# EAGLE design SAMD21_Pro_RF_1W (EAGLE 9.1.3)
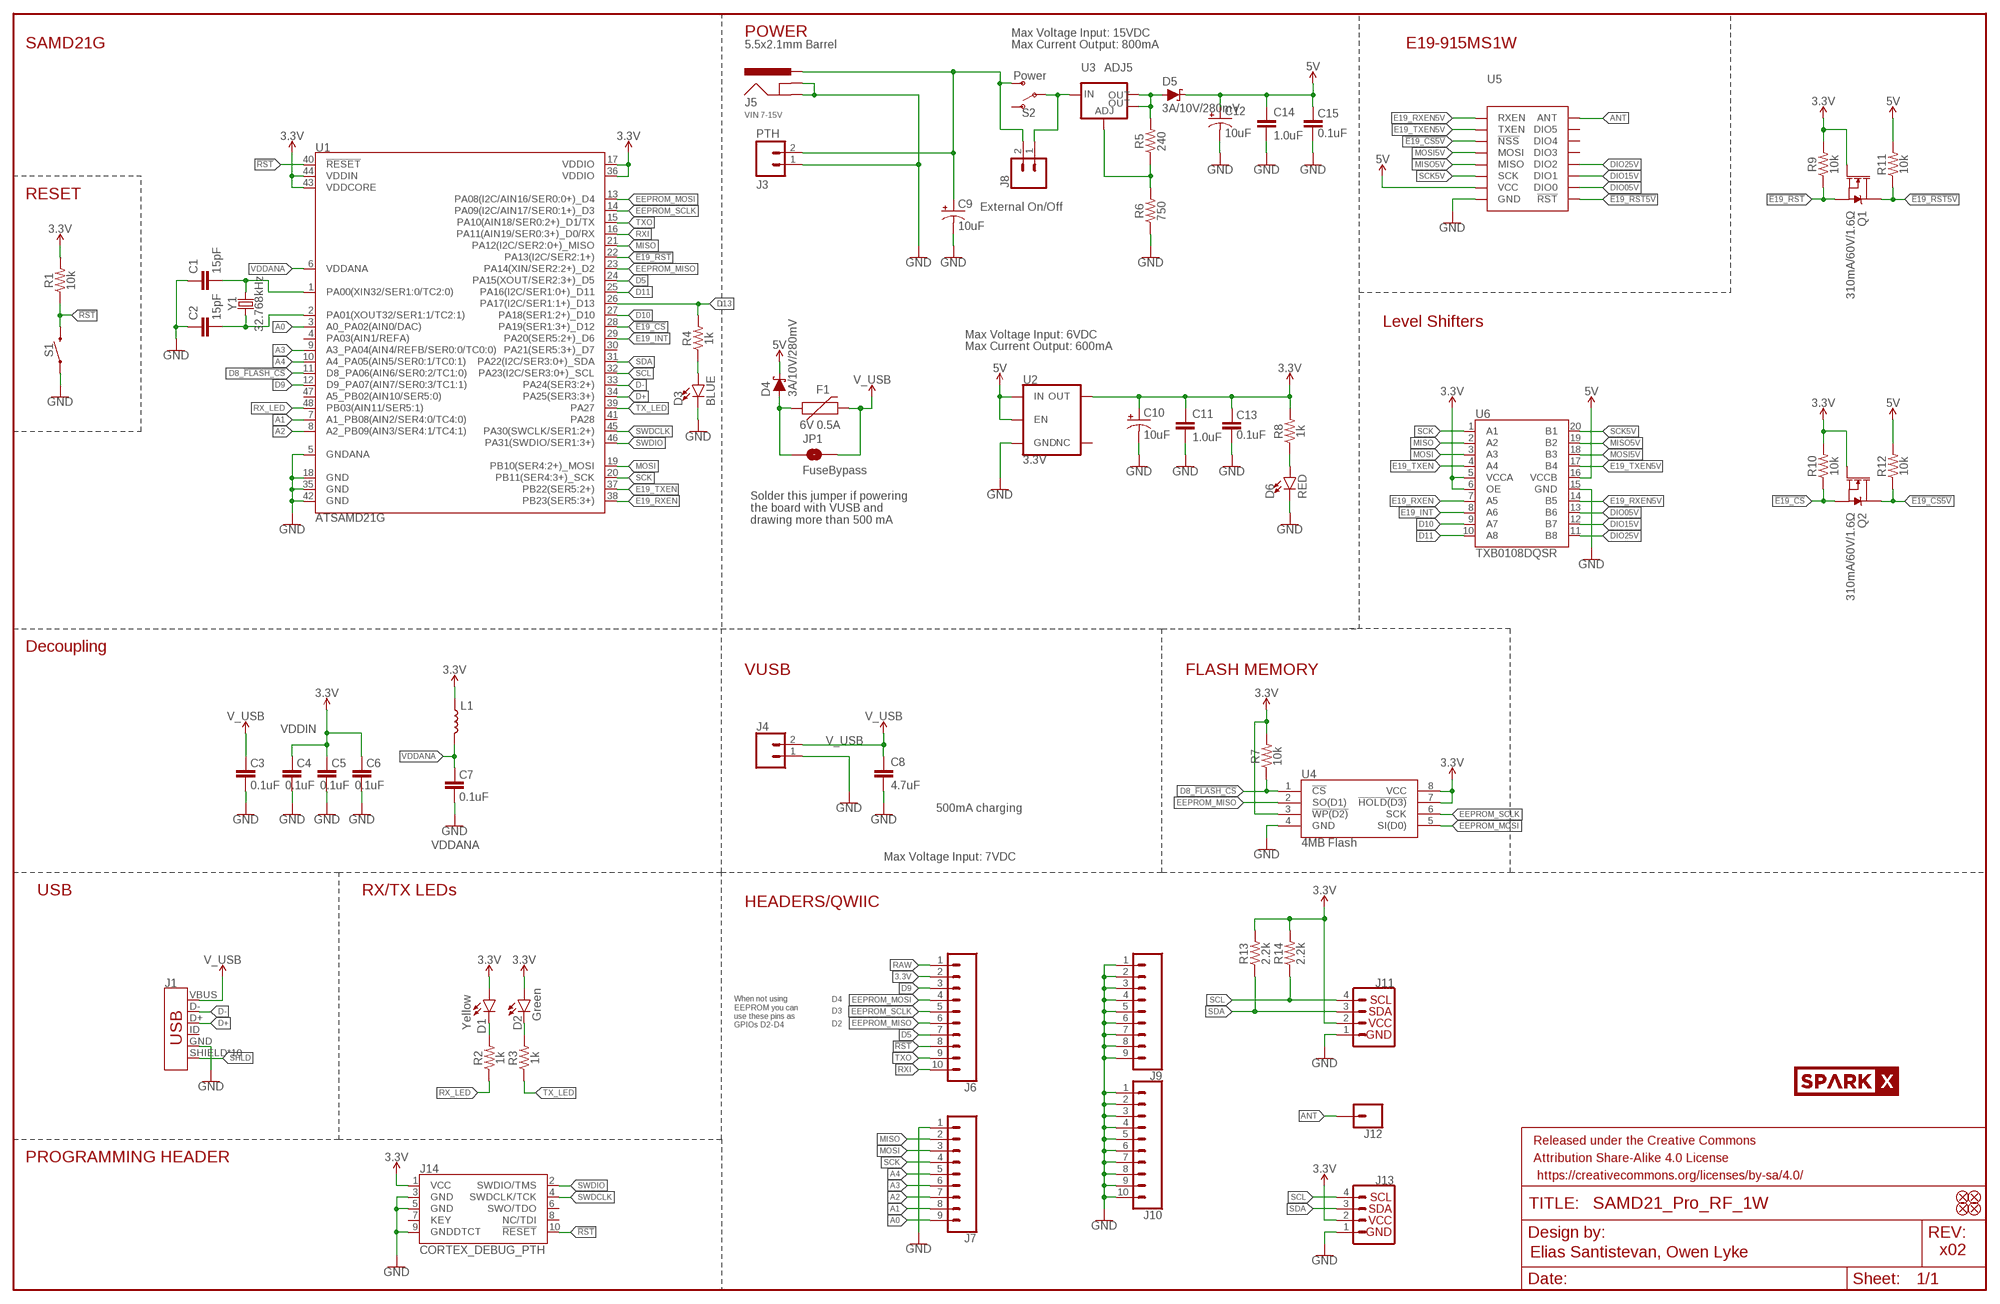
[diagram p0: schematic, sheet 1]

## Parts
C1  15pF  15PF-0603-50V-5%  [0603]
C2  15pF  15PF-0603-50V-5%  [0603]
C3  0.1uF  0.1UF-0603-25V-(+80/-20%)  [0603]
C4  0.1uF  0.1UF-0603-25V-(+80/-20%)  [0603]
C5  0.1uF  0.1UF-0603-25V-(+80/-20%)  [0603]
C6  0.1uF  0.1UF-0603-25V-(+80/-20%)  [0603]
C7  0.1uF  0.1UF-0603-25V-(+80/-20%)  [0603]
C8  4.7uF  4.7UF-0603-6.3V-(10%)  [0603]
C9  10uF  10UF-POLAR-EIA3216-16V-10%(TANT)  [EIA3216]
C10  10uF  10UF-POLAR-EIA3216-16V-10%(TANT)  [EIA3216]
C11  1.0uF  1.0UF-0603-16V-10%  [0603]
C12  10uF  10UF-POLAR-EIA3216-16V-10%(TANT)  [EIA3216]
C13  0.1uF  0.1UF-0603-25V-(+80/-20%)  [0603]
C14  1.0uF  1.0UF-0603-16V-10%  [0603]
C15  0.1uF  0.1UF-0603-25V-(+80/-20%)  [0603]
D1  Yellow  LED-YELLOW0603  [LED-0603]
D2  Green  LED-GREEN0603  [LED-0603]
D3  BLUE  LED-BLUE0603  [LED-0603]
D4  3A/10V/280mV  DIODE-SCHOTTKY-BAT60A  [SOD-323]
D5  3A/10V/280mV  DIODE-SCHOTTKY-BAT60A  [SOD-323]
D6  RED  LED-RED0603  [LED-0603]
F1  6V 0.5A  PPTC_6V500MA  [0805]
FD1  FIDUCIAL1X2  [FIDUCIAL-1X2]
FD2  FIDUCIAL1X2  [FIDUCIAL-1X2]
FD3  FIDUCIAL1X2  [FIDUCIAL-1X2]
FD4  FIDUCIAL1X2  [FIDUCIAL-1X2]
FRAME1  FRAME-LEDGER  [CREATIVE_COMMONS]
J1  USB_MICRO-B_HALF_PTH_MILL  [USB-MICROB-PTH-MILL]
J3  PTH  CONN_021X02_NO_SILK  [1X02_NO_SILK]
J4  CONN_021X02_NO_SILK  [1X02_NO_SILK]
J5  5.5x2.1mm Barrel  POWER_JACKSMD  [POWER_JACK_SMD]
J6  CONN_10NO_SILK_PTH_FEMALE  [1X10_NO_SILK]
J7  CONN_09NO_SILK  [1X09_NO_SILK]
J8  External On/Off  CONN_021X02_NO_SILK  [1X02_NO_SILK]
J9  CONN_09NO_SILK  [1X09_NO_SILK]
J10  CONN_10NO_SILK_PTH_FEMALE  [1X10_NO_SILK]
J11  QWIIC_CONNECTORJS-1MM  [1X04_1MM_RA]
J12  CONN_01PTH_NO_SILK_YES_STOP  [1X01_NO_SILK]
J13  QWIIC_CONNECTORJS-1MM  [1X04_1MM_RA]
J14  CORTEX_DEBUG_PTH  [2X5-PTH-1.27MM]
JP1  FuseBypass  JUMPER-SMT_2_NO_SILK  [SMT-JUMPER_2_NO_SILK]
L1  INDUCTORFB-30OHM  [0603]
Q1  310mA/60V/1.6Ω  MOSFET-NCH-2N7002PW  [SOT323]
Q2  310mA/60V/1.6Ω  MOSFET-NCH-2N7002PW  [SOT323]
R1  10k  10KOHM-0603-1/10W-1%  [0603]
R2  1k  1KOHM-0603-1/10W-1%  [0603]
R3  1k  1KOHM-0603-1/10W-1%  [0603]
R4  1k  1KOHM-0603-1/10W-1%  [0603]
R5  240  240OHM-0603-1/10W-1%  [0603]
R6  750  750OHM-0603-1/10W-1%  [0603]
R7  10k  10KOHM-0603-1/10W-1%  [0603]
R8  1k  1KOHM-0603-1/10W-1%  [0603]
R9  10k  10KOHM-0603-1/10W-1%  [0603]
R10  10k  10KOHM-0603-1/10W-1%  [0603]
R11  10k  10KOHM-0603-1/10W-1%  [0603]
R12  10k  10KOHM-0603-1/10W-1%  [0603]
R13  2.2k  2.2KOHM-0603-1/10W-1%  [0603]
R14  2.2k  2.2KOHM-0603-1/10W-1%  [0603]
S1  MOMENTARY-SWITCH-SPST-SMD-5.2-REDUNDANT  [TACTILE_SWITCH_SMD_5.2MM]
S2  Power  SWITCH-SPDT-SMD-RIGHT-ANGLE  [SWITCH_SPST_SMD_A]
U1  ATSAMD21G  [QFN-48_NO_EXPOSED_PAD]
U2  3.3V  V_REG_AP2112K-3.3V  [SOT23-5]
U3  ADJ5  V_REG_LM1117SOT223  [SOT223]
U4  4MB Flash  AT25SF041  [SO08]
U5  E19-915MS1W  [E19-915MS1W]
U6  TXB0108DQSR  TXB0108  [UFDFN-20]
U$34  SPARKX-LOGO4  [SPARKX-MEDIUM]
Y1  32.768kHz  CRYSTAL-32.768KHZSMD-3.2X1.5  [CRYSTAL-SMD-3.2X1.5MM]

## Nets
3.3V [vcc]: C4.2 C5.2 C6.2 C10.+ C11.1 C13.2 D1.A D2.A J6.2 J11.2 J13.2 J14.1(VCC) L1.1 Q1.1(G) Q2.1(G) R1.2 R7.2 R8.2 R9.2 R10.2 R13.2 R14.2 U1.17(VDDIO) U1.36(VDDIO) U1.43(VDDCORE) U1.44(VDDIN) U2.5(OUT) U4.3(!WP(D2)) U4.7(!HOLD(D3)) U4.8(VCC) U6.5(VCCA) U6.6(OE)
5V [vcc]: C12.+ C14.1 C15.2 D4.C D5.C R11.2 R12.2 U2.1(IN) U2.3(EN) U5.P$11(VCC) U6.16(VCCB)
!E19_CS: Q2.2(S) R10.1 U1.28(PA19(SER1:3+)_D12)
!E19_CS5V: Q2.3(D) R12.1 U5.P$15(!NSS)
!E19_RST: Q1.2(S) R9.1 U1.22(PA13(I2C/SER2:1+))
!E19_RST5V: Q1.3(D) R11.1 U5.P$8(!RST)
!RST: J6.8 J14.10(!RESET) R1.1 S1.3 S1.4 U1.40(!RESET!)
A0: J7.9 U1.3(A0_PA02(AIN0/DAC))
A1: J7.8 U1.7(A1_PB08(AIN2/SER4:0/TC4:0))
A2: J7.7 U1.8(A2_PB09(AIN3/SER4:1/TC4:1))
A3: J7.6 U1.9(A3_PA04(AIN4/REFB/SER0:0/TC0:0))
A4: J7.5 U1.10(A4_PA05(AIN5/SER0:1/TC0:1))
ANT: J12.1 U5.P$19(ANT)
D5: J6.7 U1.24(PA15(XOUT/SER2:3+)_D5)
D8_!FLASH_CS: R7.1 U1.11(D8_PA06(AIN6/SER0:2/TC1:0)) U4.1(!CS)
D9: J6.3 U1.12(D9_PA07(AIN7/SER0:3/TC1:1))
D10: U1.27(PA18(SER1:2+)_D10) U6.9(A7)
D11: U1.25(PA16(I2C/SER1:0+)_D11) U6.10(A8)
D13: R4.2 U1.26(PA17(I2C/SER1:1+)_D13)
D+: J1.D+ U1.34(PA25(SER3:3+))
D-: J1.D- U1.33(PA24(SER3:2+))
DIO05V: U5.P$7(DIO0) U6.13(B6)
DIO15V: U5.P$6(DIO1) U6.12(B7)
DIO25V: U5.P$5(DIO2) U6.11(B8)
E19_INT: U1.29(PA20(SER5:2+)_D6) U6.8(A6)
E19_RXEN: U1.38(PB23(SER5:3+)) U6.7(A5)
E19_RXEN5V: U5.P$17(RXEN) U6.14(B5)
E19_TXEN: U1.37(PB22(SER5:2+)) U6.4(A4)
E19_TXEN5V: U5.P$16(TXEN) U6.17(B4)
EEPROM_MISO: J6.6 U1.23(PA14(XIN/SER2:2+)_D2) U4.2(SO(D1))
EEPROM_MOSI: J6.4 U1.13(PA08(I2C/AIN16/SER0:0+)_D4) U4.5(SI(D0))
EEPROM_SCLK: J6.5 U1.14(PA09(I2C/AIN17/SER0:1+)_D3) U4.6(SCK)
GND: C1.1 C2.1 C3.1 C4.1 C5.1 C6.1 C7.1 C8.2 C9.- C10.- C11.2 C12.- C13.1 C14.2 C15.1 D3.C D6.C J1.GND J3.1 J4.1 J5.GND(GNDBREAK) J5.P$4(GND) J7.1 J9.1 J9.2 J9.3 J9.4 J9.5 J9.6 J9.7 J9.8 J9.9 J10.1 J10.2 J10.3 J10.4 J10.5 J10.6 J10.7 J10.8 J10.9 J10.10 J11.1 J13.1 J14.3(GND) J14.5(GND) J14.9(GNDDTCT) R6.1 S1.1 S1.2 U1.5(GNDANA) U1.18(GND) U1.35(GND) U1.42(GND) U2.2(GND) U4.4(GND) U5.P$1(GND) U5.P$9(GND) U5.P$10(GND) U5.P$18(GND) U5.P$20(GND) U5.P$21(GND) U5.P$22(GND) U6.15(GND)
MISO: J7.2 U1.21(PA12(I2C/SER2:0+)_MISO) U6.2(A2)
MISO5V: U5.P$13(MISO) U6.19(B2)
MOSI: J7.3 U1.19(PB10(SER4:2+)_MOSI) U6.3(A3)
MOSI5V: U5.P$14(MOSI) U6.18(B3)
N$1: D1.C R2.2
N$2: D2.C R3.2
N$3: D3.A R4.1
N$6: C1.2 U1.1(PA00(XIN32/SER1:0/TC2:0)) Y1.P$2
N$7: C2.2 U1.2(PA01(XOUT32/SER1:1/TC2:1)) Y1.P$1
N$12 [vcc]: D4.A F1.1 JP1.1
N$13: R5.1 R6.2 U3.1(ADJ)
N$14 [vcc]: D5.A R5.2 U3.2(OUT) U3.4(OUT)
N$38: D6.A R8.1
RAW [vcc]: J6.1 J8.1 S2.2(P) U3.3(IN)
RX_LED: R2.1 U1.48(PB03(AIN11/SER5:1))
RXI: J6.10 U1.16(PA11(AIN19/SER0:3+)_D0/RX)
SCK: J7.4 U1.20(PB11(SER4:3+)_SCK) U6.1(A1)
SCK5V: U5.P$12(SCK) U6.20(B1)
SCL: J11.4 J13.4 R14.1 U1.32(PA23(I2C/SER3:0+)_SCL)
SDA: J11.3 J13.3 R13.1 U1.31(PA22(I2C/SER3:0+)_SDA)
SHLD: J1.SHIELD J1.SHIELD2(SHIELD) J1.SHIELD3(SHIELD) J1.SHIELD4(SHIELD) J1.SHIELD5(SHIELD) J1.SHIELD6(SHIELD) J1.SHIELD7(SHIELD) J1.SHIELD8(SHIELD) J1.SHIELD9(SHIELD) J1.SHIELD10(SHIELD)
SWDCLK: J14.4(SWDCLK/TCK) U1.45(PA30(SWCLK/SER1:2+))
SWDIO: J14.2(SWDIO/TMS) U1.46(PA31(SWDIO/SER1:3+))
TX_LED: R3.1 U1.39(PA27)
TXO: J6.9 U1.15(PA10(AIN18/SER0:2+)_D1/TX)
V_USB [vcc]: C3.2 C8.1 F1.2 J1.VBUS J4.2 JP1.2
VBATT: C9.+ J3.2 J5.VIN0(PWR) J8.2 S2.3(S)
VDDANA [vcc]: C7.2 L1.2 U1.6(VDDANA)
Unconnected: J1.ID J14.6(SWO/TDO) J14.7(KEY) J14.8(NC/TDI) S2.1(O) U1.4(PA03(AIN1/REFA)) U1.30(PA21(SER5:3+)_D7) U1.41(PA28) U1.47(A5_PB02(AIN10/SER5:0)) U2.4(NC) U5.P$2(DIO5) U5.P$3(DIO4) U5.P$4(DIO3)

## Notes on the sheet
- POWER | Max Voltage Input: 15VDC
- SAMD21G | Max Current Output: 800mA | E19-915MS1W
- VIN 7-15V
- RESET
- Level Shifters
- Max Voltage Input: 6VDC
- Max Current Output: 600mA
- Solder this jumper if powering
  the board with VUSB and 
  drawing more than 500 mA
- Decoupling
- VUSB | FLASH MEMORY
- VDDIN
- 500mA charging
- VDDANA
- Max Voltage Input: 7VDC
- USB | RX/TX LEDs
- HEADERS/QWIIC
- D4
- D3
- D2
- When not using
  EEPROM you can 
  use these pins as
  GPIOs D2-D4
- PROGRAMMING HEADER
- Elias Santistevan, Owen Lyke | x02

## Library data of the parts
C1 C2 = SparkFun-Capacitors:15PF: 15pF ceramic capacitors A capacitor is a passive two-terminal electrical component used to store electrical energy temporarily in an electric field.; PROD_ID: CAP-07881
C3-C7 C13 C15 = SparkFun-Capacitors:0.1UF: 0.1µF ceramic capacitors A capacitor is a passive two-terminal electrical component used to store electrical energy temporarily in an electric field.; PROD_ID: CAP-00810
C8 = SparkFun-Capacitors:4.7UF: 4.7µF ceramic capacitors A capacitor is a passive two-terminal electrical component used to store electrical energy temporarily in an electric field.; PROD_ID: CAP-08280
C9 C10 C12 = SparkFun-Capacitors:10UF-POLAR: 10.0µF polarized capacitors A capacitor is a passive two-terminal electrical component used to store electrical energy temporarily in an electric field.; PROD_ID: CAP-00811
C11 C14 = SparkFun-Capacitors:1.0UF: 1µF ceramic capacitors A capacitor is a passive two-terminal electrical component used to store electrical energy temporarily in an electric field.; PROD_ID: CAP-00868
D1 = SparkFun-LED:LED-YELLOW: Yellow SMD LED Used in manufacturing several products at SparkFun. Packages: 0603 - SMD 0603 package[Product Link] <http://www.kingbrightusa.com/product.asp?catalog_name=LED&product_id=APT1608SYCK> 0603 -SMART - SMART SMD 0603 package (more efficient/more expensive) [Product Link] <http://www.osram-os.com/osram_os/en/products/product-catalog/led-light-emitting-diodes/smartled-0603/ly-l29k/index.jsp> LilyPad - SMD1206 package[Product Datasheet] <https://www.sparkfun.com/datasheets/DevTools/LilyPad/Q150YUS4.pdf> SparkFun Products: Blynk Board <https://www.sparkfun.com/products/13794> IOIO-OTG <https://www.sparkfun.com/products/13613> XBee Explorer Serial <https://www.sparkfun.com/products/13225>; PROD_ID: DIO-09003
D2 = SparkFun-LED:LED-GREEN: Green SMD LED Used in manufacturing of various products at SparkFun Packages: 0603 - SMD 0603 package [Product Link] <http://www.futureelectronics.com/en/technologies/semiconductors/optoelectronics/leds/Pages/9894312-LTST-C190GKT.aspx?CrossPart=HSMG-C190&IM=0> LilyPad 1206 - SMD1206 LilyPad package [Product Link] <http://www.futureelectronics.com/en/Technologies/Product.aspx?ProductID=IN150NGHARVATEKCORPORATION2049943&IM=0> 1206 - SMD1206 package [Product Link] <http://www.futureelectronics.com/en/technologies/semiconductors/optoelectronics/leds/Pages/8315665-LTST-C150KGKT.aspx?IM=0> 1206 Bottom Mount -SMD 1206 Bottom Mount [Product Link] <http://www.digikey.com/product-detail/en/lite-on-inc/LTST-C230KGKT/160-1456-1-ND/386854> SparkFun Products: Pro Mini 328 -5V <https://www.sparkfun.com/products/821> RedBoard <https://www.sparkfun.com/products/12757> MP3 Trigger <https://www.sparkfun.com/products/13720> Makey Makey <https://www.sparkfun.com/products/11076>; PROD_ID: DIO-00821; VALUE: GREEN
D3 = SparkFun-LED:LED-BLUE: Blue SMD LED Used in manufacturing of various products at SparkFun Packages: 0603 - SMD 0603 package [Product Link] <http://www.digikey.com/product-detail/en/SMLE12BC7TT86/511-1589-2-ND/1641808> 1206 - SMD1206 package [Product Link] <http://www.digikey.com/product-detail/en/lite-on-inc/LTST-C150TBKT/160-1643-1-ND/573584> SparkFun Products: ESP8266 Thing-Dev Board <https://www.sparkfun.com/products/13711> RedBoard <https://www.sparkfun.com/products/12757>; PROD_ID: DIO-08575
D4 D5 = SparkFun-DiscreteSemi:DIODE-SCHOTTKY: Schottky diode A Schottky diode is a semiconductor diode which has a low forward voltage drop and a very fast switching action.; PROD_ID: DIO-14072
D6 = SparkFun-LED:LED-RED: Red SMD LED Used in manufacturing of most products at SparkFun Packages: 0603 - SMD 0603 package [Product Link] <http://docs.avagotech.com/docs/AV02-0551EN> 0603 SMART - SMD 0603 SMART package ( more efficient and expensive)[Product Link] <http://www.osram-os.com/Graphics/XPic2/00077099_0.pdf> 1206 - SMD1206 package [Product Link] <https://www.sparkfun.com/datasheets/DevTools/LilyPad/Q150OVS4.pdff> SparkFun Products: Pro Mini 328 -5V <https://www.sparkfun.com/products/821> RedBoard <https://www.sparkfun.com/products/12757> IOIO-OTG <https://www.sparkfun.com/products/13613>; PROD_ID: DIO-00819
F1 = SparkFun-Fuses:PPTC: Resettable Fuse PPTC Resettable Fuse. Really a sort of resistor with a polymeric positive temperature coefficient whose resistance increases dramatically with an increase in temperature. When heated by the power passing through the resistance rises causing the current to be limited, protecting the circuit. This is achieved by the transition of the polymer from a crystalline to an amorphous state where the conductive carbon separates breaking the conductive pathways found in the cool crystalline structure. When a PPTC cools back down it resumes conducting letting the circuit turn back on. SparkFun Products: SparkFun RedBoard - Programmed with Arduino <https://www.sparkfun.com/products/12757> Pro Micro - 5V/16MHz <https://www.sparkfun.com/products/12640> Arduino Pro 328 - 5V/16MHz <https://www.sparkfun.com/products/10915> MP3 Trigger <https://www.sparkfun.com/products/13720>; PROD_ID: 13945
FD1-FD4 = SparkFun-Aesthetics:FIDUCIAL: Fiducial Alignment Points Point-of-reference for pick-and-place machines and other optical instruments.
FRAME1 = SparkFun-Aesthetics:FRAME-LEDGER: Schematic Frame - Ledger Standard 11x14 US Ledger frame
J1 = SparkFun-Connectors:USB_MICRO-B: USB Type Micro-B Connector Male/female and PTH/SMT variants SparkFun Products: SparkFun microB USB Breakout <https://www.sparkfun.com/products/12035> SparkFun USB microB Plug Breakout <https://www.sparkfun.com/products/10031> SparkFun ESP8266 Thing <https://www.sparkfun.com/products/13231>; PROD_ID: CONN-13711
J3 J4 J8 = SparkFun-Connectors:CONN_02: Multi connection point. Often used as Generic Header-pin footprint for 0.1 inch spaced/style header connections On any of the 0.1 inch spaced packages, you can populate with these: Break Away Headers - Straight <https://www.sparkfun.com/products/116> (PRT-00116) Break Away Male Headers - Right Angle <https://www.sparkfun.com/products/553> (PRT-00553) Female Headers <https://www.sparkfun.com/products/115> (PRT-00115) Break Away Headers - Machine Pin <https://www.sparkfun.com/products/117> (PRT-00117) Break Away Female Headers - Swiss Machine Pin <https://www.sparkfun.com/products/743> (PRT-00743) For SCREWTERMINALS and SPRING TERMINALS visit here: Screw Terimnals on SparkFun.com <https://www.sparkfun.com/search/results?term=Screw+Terminals> (5mm/3.5mm/2.54mm spacing) This device is also useful as a general connection point to wire up your design to another part of your project. Our various solder wires solder well into these plated through hole pads. Hook-Up Wire - Assortment (Stranded, 22 AWG) <https://www.sparkfun.com/products/11375> (PRT-11375) Hook-Up Wire - Assortment (Solid Core, 22 AWG) <https://www.sparkfun.com/products/11367> (PRT-11367) View the entire wire category on our website here <https://www.sparkfun.com/categories/141> Special notes: Molex polarized connector foot print use with: PRT-08233 with associated crimp pins and housings. 2.54_SCREWTERM for use with PRT-10571. 3.5mm Screw Terminal footprints for PRT-08084 5mm Screw Terminal footprints for use with PRT-08432
J5 = SparkFun-Connectors:POWER_JACK: Power Jack Connector This is the standard 5.5mm barrel jack for power. The PTH is the most common, proven, reliable, footprint. The Slot footprint only works if the mill layer is transmitted to the PCB fab house so be warned. Here are the connectors we sell at SparkFun: DC Barrel Power Jack/Connector <https://www.sparkfun.com/products/119> (PRT-00119) DC Barrel Power Jack/Connector (SMD) <https://www.sparkfun.com/products/12748> (PRT-12748) DC Barrel Jack Adapter - Breadboard Compatible <https://www.sparkfun.com/products/10811> (PRT-10811) It is used on this SparkFun product (and many, many others): SparkFun RedBoard - Programmed with Arduino <https://www.sparkfun.com/products/12757> (DEV-12757) Also, if you need a mating power supply or connector, please check these out: Wall Adapter Power Supply - 9VDC 650mA <https://www.sparkfun.com/products/298> (TOL-00298) DC Barrel Jack Adapter - Male <https://www.sparkfun.com/products/10287> (PRT-10287); PROD_ID: CONN-08106; SF_ID: PRT-12748
J6 J10 = SparkFun-Connectors:CONN_10: Multi connection point. Often used as Generic Header-pin footprint for 0.1 inch spaced/style header connections On any of the 0.1 inch spaced packages, you can populate with these: Break Away Headers - Straight <https://www.sparkfun.com/products/116> (PRT-00116) Break Away Male Headers - Right Angle <https://www.sparkfun.com/products/553> (PRT-00553) Female Headers <https://www.sparkfun.com/products/115> (PRT-00115) Break Away Headers - Machine Pin <https://www.sparkfun.com/products/117> (PRT-00117) Break Away Female Headers - Swiss Machine Pin <https://www.sparkfun.com/products/743> (PRT-00743) Arduino Stackable Header - 10 Pin <https://www.sparkfun.com/products/11376> (PRT-11376) For SCREWTERMINALS and SPRING TERMINALS visit here: Screw Terimnals on SparkFun.com <https://www.sparkfun.com/search/results?term=Screw+Terminals> (5mm/3.5mm/2.54mm spacing) This device is also useful as a general connection point to wire up your design to another part of your project. Our various solder wires solder well into these plated through hole pads. Hook-Up Wire - Assortment (Stranded, 22 AWG) <https://www.sparkfun.com/products/11375> (PRT-11375) Hook-Up Wire - Assortment (Solid Core, 22 AWG) <https://www.sparkfun.com/products/11367> (PRT-11367) View the entire wire category on our website here <https://www.sparkfun.com/categories/141> Special notes: Molex polarized connector foot print use with SKU : PRT-08231 with associated crimp pins and housings. 1MM SMD Version SKU: PRT-10208 NOTES ON THE VARIANTS LOCK and LOCK_LONGPADS... This footprint was designed to help hold the alignment of a through-hole component (i.e. 6-pin header) while soldering it into place. You may notice that each hole has been shifted either up or down by 0.005 of an inch from it's more standard position (which is a perfectly straight line). This slight alteration caused the pins (the squares in the middle) to touch the edges of the holes. Because they are alternating, it causes a "brace" to hold the component in place. 0.005 has proven to be the perfect amount of "off-center" position when using our standard breakaway headers. Although looks a little odd when you look at the bare footprint, once you have a header in there, the alteration is very hard to notice. Also,if you push a header all the way into place, it is covered up entirely on the bottom side.; PROD_ID: CONN-11563
J7 J9 = SparkFun-Connectors:CONN_09: Multi connection point. Often used as Generic Header-pin footprint for 0.1 inch spaced/style header connections On any of the 0.1 inch spaced packages, you can populate with these: Break Away Headers - Straight <https://www.sparkfun.com/products/116> (PRT-00116) Break Away Male Headers - Right Angle <https://www.sparkfun.com/products/553> (PRT-00553) Female Headers <https://www.sparkfun.com/products/115> (PRT-00115) Break Away Headers - Machine Pin <https://www.sparkfun.com/products/117> (PRT-00117) Break Away Female Headers - Swiss Machine Pin <https://www.sparkfun.com/products/743> (PRT-00743) For SCREWTERMINALS and SPRING TERMINALS visit here: Screw Terimnals on SparkFun.com <https://www.sparkfun.com/search/results?term=Screw+Terminals> (5mm/3.5mm/2.54mm spacing) This device is also useful as a general connection point to wire up your design to another part of your project. Our various solder wires solder well into these plated through hole pads. Hook-Up Wire - Assortment (Stranded, 22 AWG) <https://www.sparkfun.com/products/11375> (PRT-11375) Hook-Up Wire - Assortment (Solid Core, 22 AWG) <https://www.sparkfun.com/products/11367> (PRT-11367) View the entire wire category on our website here <https://www.sparkfun.com/categories/141> Special notes: Molex polarized connector foot print use with SKU : PRT-08231 with associated crimp pins and housings. 1MM SMD Version SKU: PRT-10208 NOTES ON THE VARIANTS LOCK and LOCK_LONGPADS... This footprint was designed to help hold the alignment of a through-hole component (i.e. 6-pin header) while soldering it into place. You may notice that each hole has been shifted either up or down by 0.005 of an inch from it's more standard position (which is a perfectly straight line). This slight alteration caused the pins (the squares in the middle) to touch the edges of the holes. Because they are alternating, it causes a "brace" to hold the component in place. 0.005 has proven to be the perfect amount of "off-center" position when using our standard breakaway headers. Although looks a little odd when you look at the bare footprint, once you have a header in there, the alteration is very hard to notice. Also,if you push a header all the way into place, it is covered up entirely on the bottom side.
J11 J13 = SparkFun-Connectors:QWIIC_CONNECTOR: SparkFun I2C Standard Qwiic Connector An SMD 1mm pitch JST connector makes it easy and quick (get it? Qwiic?) to connect I2C devices to each other. The Qwiic system <http://www.sparkfun.com/qwiic> enables fast and solderless connection between popular platforms and various sensors and actuators. We carry 200mm <https://www.sparkfun.com/products/14204>, 100mm <https://www.sparkfun.com/products/14205>, 50mm <https://www.sparkfun.com/products/14206>, and breadboard friendly <https://www.sparkfun.com/products/14207> Qwiic cables. We also offer 10 pcs strips <https://www.sparkfun.com/products/14323> the SMD connectors.; PROD_ID: CONN-13694
J12 = SparkFun-Connectors:CONN_01: Single connection point. Often used as Generic Header-pin footprint for 0.1 inch spaced/style header connections On any of the 0.1 inch spaced packages, you can populate with these: Break Away Headers - Straight <https://www.sparkfun.com/products/116> (PRT-00116) Break Away Male Headers - Right Angle <https://www.sparkfun.com/products/553> (PRT-00553) Female Headers <https://www.sparkfun.com/products/115> (PRT-00115) Break Away Headers - Machine Pin <https://www.sparkfun.com/products/117> (PRT-00117) Break Away Female Headers - Swiss Machine Pin <https://www.sparkfun.com/products/743> (PRT-00743) This device is also useful as a general connection point to wire up your design to another part of your project. Our various solder wires solder well into these plated through hole pads. Hook-Up Wire - Assortment (Stranded, 22 AWG) <https://www.sparkfun.com/products/11375> (PRT-11375) Hook-Up Wire - Assortment (Solid Core, 22 AWG) <https://www.sparkfun.com/products/11367> (PRT-11367) View the entire wire category on our website here <https://www.sparkfun.com/categories/141> Special notes: SMTSO-256-ET is a "flush mount" nut for a 4-40 screw. We mostly use this on specialty testbeds; it is a nice way to connect hardware to your PCB at an adjustable hieght. Also note, the SNAP packages are for using a snappable style connector. We sell a baggie of snaps and they are also used on two LilyPad designs: Snap Assortment - 30 pack (male and female) <https://www.sparkfun.com/products/11347> (DEV-11347) LilyPad Arduino SimpleSnap <https://www.sparkfun.com/products/10941> (DEV-10941) LilyPad SimpleSnap Protoboard <https://www.sparkfun.com/products/10940> (DEV-10940)
J14 = SparkFun-Connectors:CORTEX_DEBUG: Cortex Debug Connector - 10 pin Supports JTAG debug, Serial Wire debug, and Serial Wire Viewer. PTH and SMD connector options available. General Connector Information <http://infocenter.arm.com/help/topic/com.arm.doc.faqs/attached/13634/cortex_debug_connectors.pdf> Products: PTH Connector <http://www.digikey.com/product-detail/en/cnc-tech/3220-10-0100-00/1175-1627-ND/3883661> -via Digi-Key SparkFun PSoc <https://www.sparkfun.com/products/13229> SparkFun T <https://www.sparkfun.com/products/13810>
JP1 = SparkFun-Jumpers:JUMPER-SMT_2_NO: Normally open jumper This jumper has two pads in close proximity to each other. Apply solder to close the connection. Round pads are easier to solder for beginners, but are a lot larger. SparkFun Product that uses the round pads: SparkFun EL Sequencer <https://www.sparkfun.com/products/12781>
L1 = SparkFun-Coils:INDUCTOR: Inductors Resist changes in electrical current. Basically a coil of wire. SparkFun Products: SparkFun Load Cell Amplifier - HX711 <https://www.sparkfun.com/products/13879> IOIO-OTG - V2.2 <https://www.sparkfun.com/products/13613>; PROD_ID: NDUC-07859
Q1 Q2 = SparkFun-DiscreteSemi:MOSFET-NCH: N-channel MOSFETs Voltage controlled devices that allow control of high current outputs. SparkFun Products: SparkFun OpenScale <https://www.sparkfun.com/products/13261> SparkFun Digital Sandbox <https://www.sparkfun.com/products/12651> SparkFun Monster Moto Shield <https://www.sparkfun.com/products/10182> SparkFun MOSFET Power Controller <https://www.sparkfun.com/products/11214>; PROD_ID: TRANS-11151
R1 R7 R9-R12 = SparkFun-Resistors:10KOHM: 10kΩ resistor A resistor is a passive two-terminal electrical component that implements electrical resistance as a circuit element. Resistors act to reduce current flow, and, at the same time, act to lower voltage levels within circuits. - Wikipedia; PROD_ID: RES-00824
R2-R4 R8 = SparkFun-Resistors:1KOHM: 1kΩ resistor A resistor is a passive two-terminal electrical component that implements electrical resistance as a circuit element. Resistors act to reduce current flow, and, at the same time, act to lower voltage levels within circuits. - Wikipedia; PROD_ID: RES-07856
R5 = SparkFun-Resistors:240OHM: 240Ω resistor A resistor is a passive two-terminal electrical component that implements electrical resistance as a circuit element. Resistors act to reduce current flow, and, at the same time, act to lower voltage levels within circuits. - Wikipedia; PROD_ID: RES-07849
R6 = SparkFun-Resistors:750OHM: 750Ω resistor A resistor is a passive two-terminal electrical component that implements electrical resistance as a circuit element. Resistors act to reduce current flow, and, at the same time, act to lower voltage levels within circuits. - Wikipedia; PROD_ID: RES-07824
R13 R14 = SparkFun-Resistors:2.2KOHM: 2.2kΩ resistor A resistor is a passive two-terminal electrical component that implements electrical resistance as a circuit element. Resistors act to reduce current flow, and, at the same time, act to lower voltage levels within circuits. - Wikipedia; PROD_ID: RES-08272
S1 = SparkFun-Switches:MOMENTARY-SWITCH-SPST: Momentary Switch (Pushbutton) - SPST Normally-open (NO) SPST momentary switches (buttons, pushbuttons). Variants PTH-12MM - 12mm square, through-hole Momentary Pushbutton Switch - 12mm Square <https://www.sparkfun.com/products/9190> (COM-09190) PTH-6.0MM, PTH-6.0MM-KIT - 6.0mm square, through-hole Mini Pushbutton Switch <https://www.sparkfun.com/products/97> (COM-00097) KIT package intended for soldering kit's - only one side of pads' copper is exposed. PTH-RIGHT-ANGLE-KIT - Right-angle, through-hole Right Angle Tactile Button <https://www.sparkfun.com/products/10791> - Used on SparkFun BigTime Watch Kit <https://www.sparkfun.com/products/11734> SMD-12MM - 12mm square, surface-mount Tactile Button - SMD (12mm) <https://www.sparkfun.com/products/12993> (COM-12993) Used on SparkFun PicoBoard <https://www.sparkfun.com/products/11888> SMD-4.5MM - 4.5mm Square Trackball Switch Used on SparkFun Blackberry Trackballer Breakout <https://www.sparkfun.com/products/13169> SMD-4.6MMX2.8MM - 4.60mm x 2.80mm, surface mount Used on SparkFun SAMD21 Mini Breakout <https://www.sparkfun.com/products/13664> SMD-5.2MM, SMD-5.2-REDUNDANT - 5.2mm square, surface-mount Mini Pushbutton Switch - SMD <https://www.sparkfun.com/products/8720> (COM-08720) Used on Arduino Pro Mini <https://www.sparkfun.com/products/11114> REDUNDANT package connects both switch circuits together SMD-6.0X3.5MM - 6.0 x 3.5mm, surface mount Momentary Reset Switch SMD <https://www.sparkfun.com/products/8229> (COM-08229) SMD-6.2MM-TALL - 6.2mm square, surface mount Tactile Button - SMD (6mm) <https://www.sparkfun.com/products/12992> Used on SparkFun Digital Sandbox <https://www.sparkfun.com/products/12651> SMD-RIGHT-ANGLE - Right-angle, surface mount Used on SparkFun Block for Intel® Edison - Arduino <https://www.sparkfun.com/products/13036>; PROD_ID: SWCH-08247; SF_SKU: COM-08720
S2 = SparkFun-Switches:SWITCH-SPDT: Single Pole, Double Throw (SPDT) Switch Single-pole, double-throw (SPDT) switch. Variant Overview SMD-AYZ0202 Surface Mount DPDT Switch <https://www.sparkfun.com/products/597> (COM-00597) Used on e.g. LilyPad Arduino USB - ATmega32U4 Board <https://www.sparkfun.com/products/12049> PTH-11.6X4.0MM SPDT Mini Power Switch <https://www.sparkfun.com/products/102> (COM-00102) Used on e.g. SparkFun Simon Says - Through-Hole Soldering Kit <https://www.sparkfun.com/products/10547> (KIT-10547) PTH-11.6X4.0MM-KIT KIT version of SPDT Mini Power Switch - Simplifies soldering by removing tStop of switch pins - only one side can be soldered. PTH-11.6X4.0MM-LOCK LOCK version of SPDT Mini Power Switch - Offset pins hold switch in place for easier soldering. SMD-RIGHT-ANGLE Surface Mount Right Angle Switch <https://www.sparkfun.com/products/10860> (COM-10860) Used on e.g. SparkFun ESP8266 Thing <https://www.sparkfun.com/products/13231>; PROD_ID: SWCH-10651; SF_SKU: COM-10860
U1 = SparkFun-IC-Microcontroller:ATSAMD21G: Atmel SAMD21G SMART ARM-Based Microcontroller The Atmel ® | SMART ™ SAM D21 is a series of low-power microcontrollers using the 32-bit ARM ® Cortex ® -M0+ processor, and ranging from 32- to 64-pins with up to 256KB Flash and 32KB of SRAM. The SAM D21 devices operate at a maximum frequency of 48MHz and reach 2.46 CoreMark/MHz. They are designed for simple and intuitive migration with identical peripheral modules, hex compatible code, identical linear address map and pin compatible migration paths between all devices in the product series. All devices include intelligent and flexible peripherals, Atmel Event System for inter-peripheral signaling, and support for capacitive touch button, slider and wheel user interfaces. Datasheet <https://cdn.sparkfun.com/datasheets/Dev/Arduino/Boards/Atmel-42181-SAM-D21_Datasheet.pdf> SparkFun Products SparkFun SAMD21 Mini Breakout <https://www.sparkfun.com/products/13664> (DEV-13664) SparkFun SAMD21 Dev Breakout <https://www.sparkfun.com/products/13672> (DEV-13672) (DEV-14926); PROD_ID: IC-14066
U2 = SparkFun-IC-Power:V_REG_AP2112: AP2112 - 600mA CMOS LDO Regulator w/ Enable The AP2112 is CMOS process low dropout linear regulator with enable function, the regulator delivers a guaranteed 600mA (min.) continuous load current. Features Output Voltage Accuracy: ±1.5% Output Current: 600mA (Min.) Foldback Short Current Protection: 50mA Enable Function to Turn ON/OFF VOUT Low Dropout Voltage (3.3V): 250mV (Typ.) @IOUT=600mA Excellent Load Regulation: 0.2%/A (Typ.) Excellent Line Regulation: 0.02%/V (Typ.) Low Quiescent Current: 55μA (Typ.) Low Standby Current: 0.01μA (Typ.) Low Output Noise: 50μVRMS PSRR: 100Hz -65dB, 1kHz -65dB OTSD Protection Stable with 1.0μF Flexible Cap: Ceramic, Tantalum and Aluminum Electrolytic Operation Temperature Range: -40°C to 85°C ESD: MM 400V, HBM 4000V; PROD_ID: VREG-12457
U3 = SparkFun-IC-Power:V_REG_LM1117: Voltage Regulator LM1117 Standard adjustable voltage regulator but in SMD form. Spark Fun Electronics SKU : COM-00595; PROD_ID: VREG-08170
U4 = SparkFun-IC-Memory:AT25SF041: AT25SF041 4Mb Serial Flash Memory 104MHz, SPI, 8-SOIC Datasheet <http://www.adestotech.com/wp-content/uploads/DS-AT25SF041_044.pdf> SparkFun Products: SparkFun ESP8266 Thing <https://www.sparkfun.com/products/13231> SparkFun ESP8266 Thing - Dev Board <https://www.sparkfun.com/products/13711>; PROD_ID: IC-12455
U5 = SparkFun-RF:E19-915MS1W: Chengdu Ebyte E19-915M30S - 915M LoRa (FSK) TRX Using SX1276 This is a 915 MHz LoRa (or optionally FSK) modulated transciver bassed on the Semtech SX1276. It has a high ouput power of 1W an a pre-installed U.FL connector. Can be used with LoRa WAN with DIO0, DIO1, and DIO2 hooked up to controller interrupt inputs SparkFun Products: SAMD21 Pro RF 1W <https://www.sparkfun.com/products/15034>; PROD_ID: IC-14076
U6 = SparkFun-IC-Comms:TXB0108: 8-Bit Bi-Directional Level Shifter 1.2V-3.6V (VCCA) to 1.65V-5.5V (VCCB) bi-directional level shifter with auto direction sensing. Max data rate - VCCA 1.2V: 20Mbps (50ns), VCCA 3.3V: 100Mbps (10ns) Digikey: 296-27217-1-ND (20-UFDFN) SparkFun Products SparkFun GPS Logger Shield <https://www.sparkfun.com/products/13750> (GPS-13750) SparkFun Block for Intel® Edison - microSD <https://www.sparkfun.com/products/13041> (DEV-13041) SparkFun Block for Intel® Edison - Dual H-Bridge <https://www.sparkfun.com/products/13043> (DEV-13043) SparkFun Block for Intel® Edison - GPIO <https://www.sparkfun.com/products/13038> (DEV-13038) SparkFun Block for Intel® Edison - Raspberry Pi B <https://www.sparkfun.com/products/13044> (DEV-13044); PROD_ID: IC-12292
U$34 = SparkX:SPARKX-LOGO
Y1 = SparkFun-Clocks:CRYSTAL-32.768KHZ: 32.768kHz Crystal Frequency: 32.768kHz Frequency Stability: ±20ppm Load Capacitance: 12.5pF (PTH-2X6 & SMD-3.2X1.5), 6pF (SMD-2X6) SparkFun Products: SparkFun BigTime Watch Kit <https://www.sparkfun.com/products/11734> SparkFun nRF52832 Breakout <https://www.sparkfun.com/products/13990> SparkFun Real Time Clock Module <https://www.sparkfun.com/products/12708>; PROD_ID: XTAL-13062

## Net classes
0 default: width 0 mm, drill 0 mm
1 vcc: width 0 mm

## Board
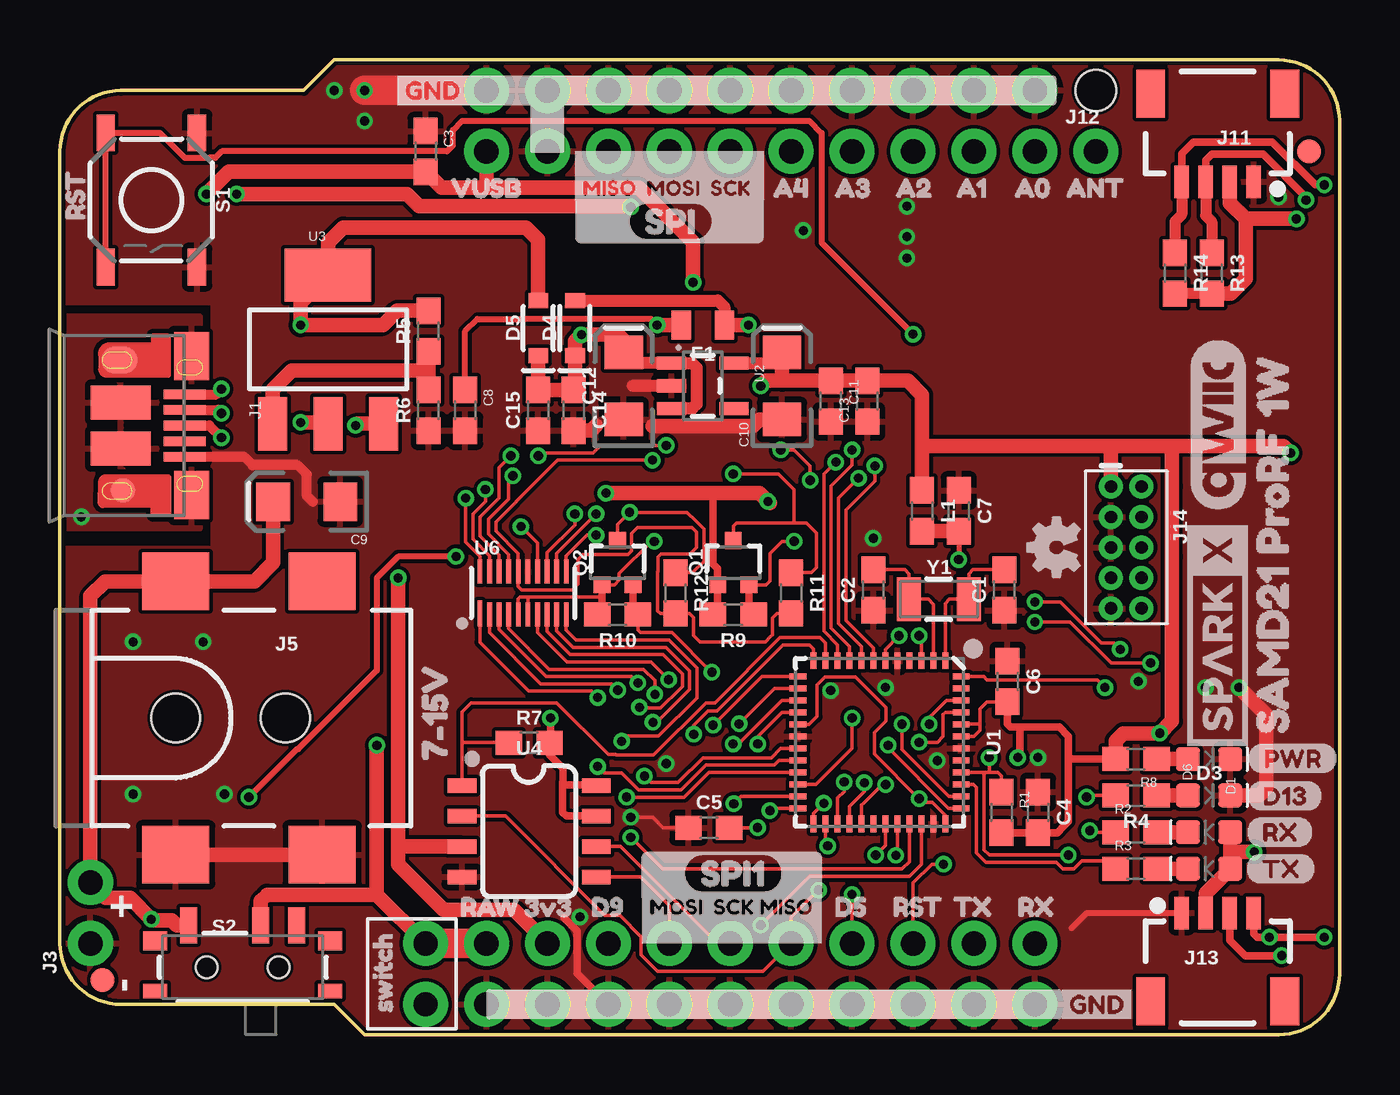
[diagram p1: board, top side]
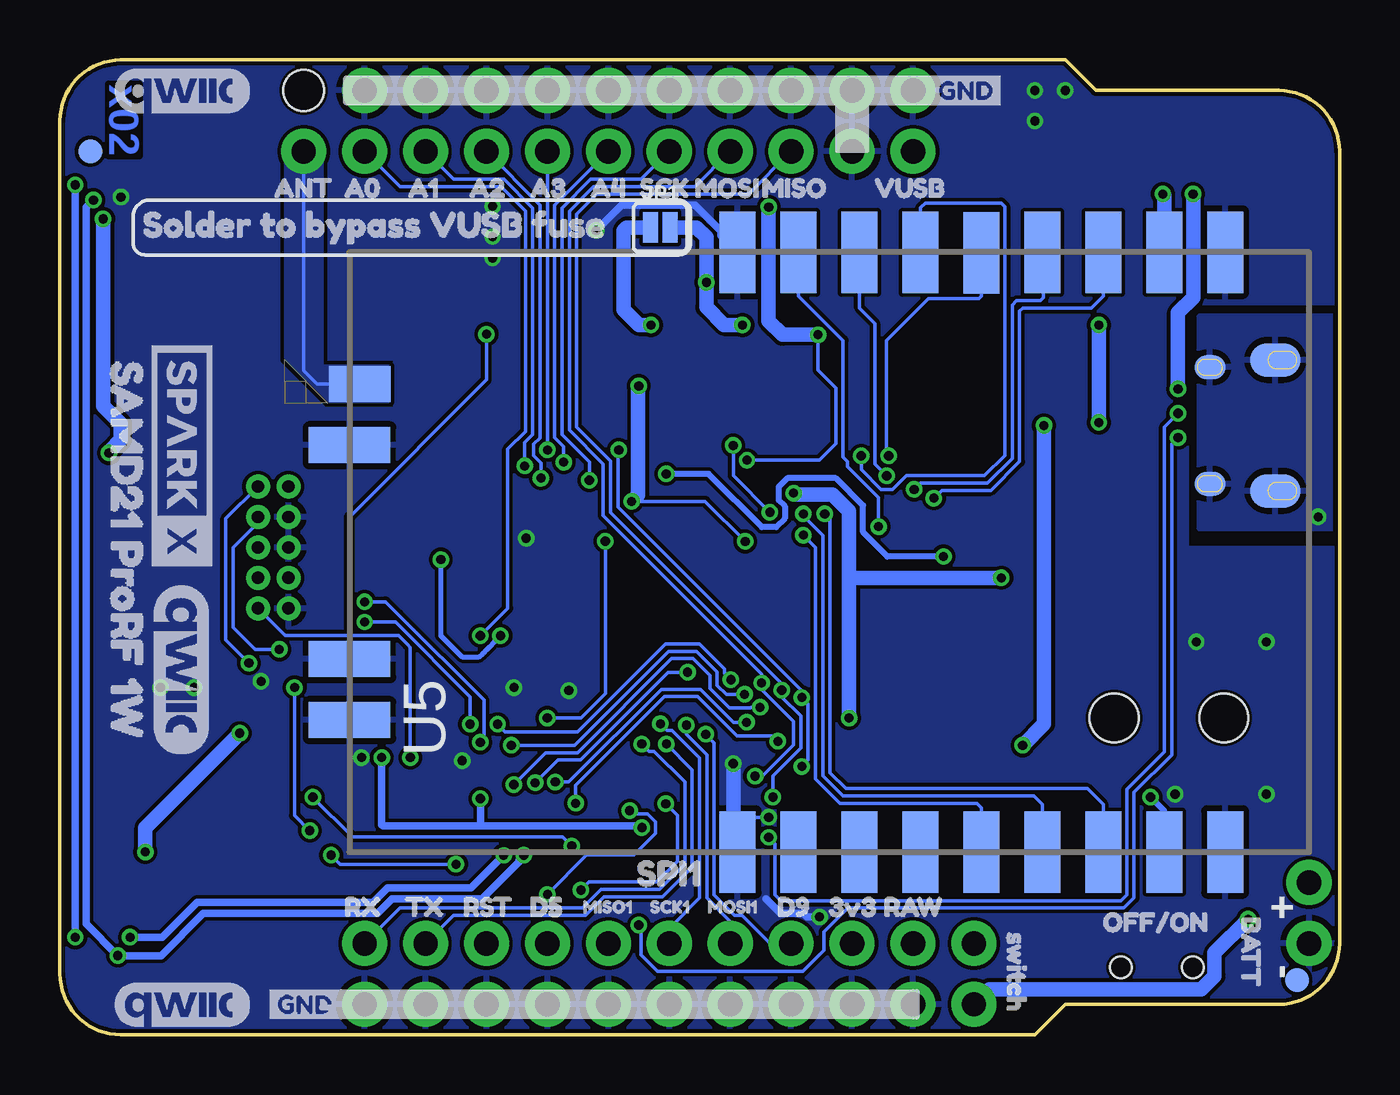
[diagram p2: board, bottom side, seen from below]

Size 53.34 x 40.64 mm. Coordinates in mm from the lower left corner, seen from the top.
Outline: 11.43,1.27 12.7,0 50.8,0 arc90 53.34,2.54 53.34,38.1 arc90 50.8,40.64 11.43,40.64 10.16,39.37 2.54,39.37 arc90 0,36.83 0,3.81 arc90 2.54,1.27 11.43,1.27
Copper layers (1*16): Top 0.035mm / dielectric 1.5mm / Bottom 0.035mm
Design rules "SparkFun-2-layer-PCBWay-LIMIT": minimum track width 6mil, minimum drill 0.3mm, track to track 6mil, track to pad 6mil, pad to pad 6mil, via to via 6mil, smd to smd 6mil, copper to edge 6mil, drill to drill 6mil, minimum pad ring 6mil, minimum via ring 6mil, stop-mask expansion 4mil, vias tented up to drill 25mil, thermal gap 10mil
Holes 1.7 mm at 43.18,39.37

### Footprints (pad centres in the part's own frame; a part is rotated, then mirrored left to right if it is on the bottom)
0603 = smd 1.1 x 1: 1 -0.85,0; 2 0.85,0
EIA3216 = smd 1.4 x 1.6: + 1.4,0; - -1.4,0
LED-0603 = smd 1 x 1: A -0.877,0; C 0.877,0
SOD-323 = smd 0.63 x 0.83: A 1.15,0; C -1.15,0
0805 = smd 0.8 x 1.2: 1 -0.9,0; 2 0.9,0
FIDUCIAL-1X2 = smd 1 x 1: 1 0,0
USB-MICROB-PTH-MILL = smd 0.4 x 1.75: D+ 0,0; D- -0.65,0; GND 1.3,0; ID 0.65,0; VBUS -1.3,0 | smd 2 x 1.46: SHIELD -2.9,0.275; SHIELD2 2.9,0.275 | smd 1.425 x 2.5: SHIELD3 -0.963,-2.675; SHIELD4 0.963,-2.675 | smd 1.4 x 2.1 bottom: SHIELD5 -2.731,-2.531; SHIELD7 2.729,-2.531 | smd 1 x 1: SHIELD6 2.7,-2.575 | smd 1.1 x 1.5: SHIELD8 -2.731,-2.731 | smd 1 x 1.3 bottom: SHIELD9 -2.43,0.195; SHIELD10 2.43,0.195
1X02_NO_SILK = drill 1.016 pad 1.88: 1 0,0; 2 2.54,0
POWER_JACK_SMD = smd 2.8 x 2.4: GND 0,-5.7; P$4 6.1,-5.7; VIN0 0,5.7; VIN1 6.1,5.7 | hole 2.032: 0,0; 4.572,0
1X10_NO_SILK = drill 1.016 pad 1.88: 1 0,0; 2 2.54,0; 3 5.08,0; 4 7.62,0; 5 10.16,0; 6 12.7,0; 7 15.24,0; 8 17.78,0; 9 20.32,0; 10 22.86,0
1X09_NO_SILK = drill 1.016 pad 1.88: 1 0,0; 2 2.54,0; 3 5.08,0; 4 7.62,0; 5 10.16,0; 6 12.7,0; 7 15.24,0; 8 17.78,0; 9 20.32,0
1X04_1MM_RA = smd 0.6 x 1.35: 1 -1.5,0; 2 -0.5,0; 3 0.5,0; 4 1.5,0 | smd 1.2 x 2: NC1 2.8,-3.675; NC2 -2.8,-3.675
1X01_NO_SILK = drill 1.016 pad 1.88: 1 0,0
2X5-PTH-1.27MM = drill 0.508 pad 1: 1 -2.54,-0.635; 2 -2.54,0.635; 3 -1.27,-0.635; 4 -1.27,0.635; 5 0,-0.635; 6 0,0.635; 7 1.27,-0.635; 8 1.27,0.635; 9 2.54,-0.635; 10 2.54,0.635
SMT-JUMPER_2_NO_SILK = smd 0.635 x 1.27: 1 -0.406,0; 2 0.406,0
SOT323 = smd 0.7 x 0.7: 1 -0.65,-0.925; 2 0.65,-0.925; 3 0,0.925
TACTILE_SWITCH_SMD_5.2MM = smd 1.524 x 0.762: 1 -2.794,1.905; 2 2.794,1.905; 3 -2.794,-1.905; 4 2.794,-1.905
SWITCH_SPST_SMD_A = smd 0.7 x 1.5: 1 -2.25,-1.75; 2 -0.75,-1.75; 3 2.25,-1.75 | smd 1 x 0.6: GND1 -3.65,1; GND3 3.65,1 | smd 1 x 0.8: GND2 -3.65,-1.1; GND4 3.65,-1.1 | hole 0.9: -1.5,0; 1.5,0
QFN-48_NO_EXPOSED_PAD = smd 0.7 x 0.25: 1 -3.4,2.75; 2 -3.4,2.25; 3 -3.4,1.75; 4 -3.4,1.25; 5 -3.4,0.75; 6 -3.4,0.25; 7 -3.4,-0.25; 8 -3.4,-0.75; 9 -3.4,-1.25; 10 -3.4,-1.75; 11 -3.4,-2.25; 12 -3.4,-2.75; 25 3.4,-2.75; 26 3.4,-2.25; 27 3.4,-1.75; 28 3.4,-1.25; 29 3.4,-0.75; 30 3.4,-0.25; 31 3.4,0.25; 32 3.4,0.75; 33 3.4,1.25; 34 3.4,1.75; 35 3.4,2.25; 36 3.4,2.75 | smd 0.25 x 0.7: 13 -2.75,-3.4; 14 -2.25,-3.4; 15 -1.75,-3.4; 16 -1.25,-3.4; 17 -0.75,-3.4; 18 -0.25,-3.4; 19 0.25,-3.4; 20 0.75,-3.4; 21 1.25,-3.4; 22 1.75,-3.4; 23 2.25,-3.4; 24 2.75,-3.4; 37 2.75,3.4; 38 2.25,3.4; 39 1.75,3.4; 40 1.25,3.4; 41 0.75,3.4; 42 0.25,3.4; 43 -0.25,3.4; 44 -0.75,3.4; 45 -1.25,3.4; 46 -1.75,3.4; 47 -2.25,3.4; 48 -2.75,3.4
SOT23-5 = smd 0.55 x 1.2: 1 -0.95,-1.3; 2 0,-1.3; 3 0.95,-1.3; 4 0.95,1.3; 5 -0.95,1.3
SOT223 = smd 1.219 x 2.235: 1 -2.311,-3.099; 2 0,-3.099; 3 2.311,-3.099 | smd 3.6 x 2.2: 4 0,3.099
SO08 = smd 0.6 x 1.2: 1 -1.905,-2.8; 2 -0.635,-2.8; 3 0.635,-2.8; 4 1.905,-2.8; 5 1.905,2.8; 6 0.635,2.8; 7 -0.635,2.8; 8 -1.905,2.8
E19-915MS1W = smd 3.4 x 1.5: P$1 0,23.82; P$2 0,21.28; P$3 0,18.74; P$4 0,16.2; P$5 0,13.66; P$6 0,11.12; P$7 0,8.58; P$8 0,6.04; P$9 0,3.5; P$10 25,3.5; P$11 25,6.04; P$12 25,8.58; P$13 25,11.12; P$14 24.98,13.66; P$15 25,16.2; P$16 25,18.74; P$17 25,21.28; P$18 25,23.82 | smd 1.5 x 2.55: P$19 19.5,39.568 | smd 1.5 x 3.4: P$20 16.96,40; P$21 8.04,40; P$22 5.5,40
UFDFN-20 = smd 0.2 x 1.1: 1 -1.8,-0.85 | smd 0.2 x 1: 2 -1.4,-0.9; 3 -1,-0.9; 4 -0.6,-0.9; 5 -0.2,-0.9; 6 0.2,-0.9; 7 0.6,-0.9; 8 1,-0.9; 9 1.4,-0.9; 10 1.8,-0.9; 11 1.8,0.9; 12 1.4,0.9; 13 1,0.9; 14 0.6,0.9; 15 0.2,0.9; 16 -0.2,0.9; 17 -0.6,0.9; 18 -1,0.9; 19 -1.4,0.9; 20 -1.8,0.9
CRYSTAL-SMD-3.2X1.5MM = smd 1 x 1.8: P$1 -1.25,0; P$2 1.25,0

### Placement (x,y rotation side)
C1  39.37,18.54 90 top
C2  33.91,18.54 90 top
C3  15.24,36.83 270 top
C4  40.77,9.27 270 top
C5  27.05,8.64 0 top
C6  39.5,14.73 270 top
C7  37.47,21.84 270 top
C8  16.89,26.04 270 top
C9  10.29,22.23 180 top
C10  30.1,27.05 90 top
C11  32.13,26.42 270 top
C12  23.5,27.05 90 top
C13  33.66,26.42 90 top
C14  21.41,26.04 270 top
C15  19.94,26.04 90 top
D1  47.9,8.45 180 top
D2  47.9,6.92 180 top
D3  47.9,9.98 0 top
D4  21.46,29.46 90 top
D5  19.94,29.46 90 top
D6  47.9,11.49 0 top
F1  26.8,29.59 180 top
FD1  52.07,36.83 0 bottom
FD2  1.78,2.29 0 top
FD3  1.78,2.29 0 bottom
FD4  52.07,36.83 0 top
FRAME1  -13.97,-12.7 0 top  (outside the outline)
J1  5.21,25.4 270 top
J3  1.27,3.81 90 top
J4  17.78,39.37 270 top
J5  4.83,13.21 0 top
J6  17.78,3.81 0 top
J7  20.32,36.83 0 top
J8  15.24,3.81 270 top
J9  20.32,39.37 0 top
J10  17.78,1.27 0 top
J11  48.26,35.56 180 top
J12  43.18,36.83 0 top
J13  48.26,5.08 0 top
J14  44.45,20.32 270 top
JP1  28.32,33.66 0 bottom
L1  35.94,21.84 270 top
Q1  28.07,19.68 0 top
Q2  23.24,19.68 0 top
R1  39.24,9.27 270 top
R2  44.86,8.45 0 top
R3  44.86,6.92 0 top
R4  44.86,9.98 180 top
R5  15.37,29.34 90 top
R6  15.37,26.04 90 top
R7  19.56,12.17 0 top
R8  44.86,11.49 180 top
R9  28.07,17.53 180 top
R10  23.24,17.53 180 top
R11  30.48,18.41 270 top
R12  25.65,18.41 270 top
R13  48.01,31.75 270 top
R14  46.48,31.75 270 top
S1  3.81,34.8 270 top
S2  7.62,2.82 180 top
U1  34.16,12.19 270 top
U2  26.8,27.05 270 top
U3  11.18,28.57 0 top
U4  19.56,8.48 270 top
U5  1.27,7.62 90 bottom
U6  19.3,18.41 0 top
U$1  [VUSB7]  15.62,35.31 0 top
U$2  [MISO4]  28.57,5.33 0 top
U$3  [A43]  29.08,35.31 0 top
U$4  [A34]  31.62,35.31 0 top
U$5  [A25]  34.16,35.31 0 top
U$6  [A16]  36.7,35.31 0 top
U$7  [A07]  39.12,35.31 0 top
U$8  [SPI2]  23.5,33.91 0 top
U$9  [MOSI3]  23.88,35.31 0 top
U$10  [MISO4]  21.21,35.31 0 top
U$11  [ANT11]  41.27,35.31 0 top
U$12  [GND0]  13.72,39.37 0 top
U$13  [RST2]  34.04,5.33 0 top
U$14  [VUSB7]  20.07,35.31 0 bottom
U$15  [D90]  21.46,5.33 0 top
U$16  [D90]  24.13,5.33 0 bottom
U$17  [GND0]  41.4,1.27 0 top
U$18  [SCK5]  26.67,5.33 0 top
U$19  [RX2]  42.16,5.33 0 bottom
U$20  [MOSI3]  24,5.33 0 top
U$21  [SPI11]  25.78,6.73 0 top
U$22  [MISO17]  32,5.33 0 bottom
U$23  [3V320]  18.67,5.33 0 top
U$24  [RAW21]  16,5.33 0 top
U$25  [7#15V0]  15.62,10.54 90 top
U$26  [SAMD21_PRORF_1W5]  50.55,29.21 270 bottom
U$27  [SWITCH6]  13.46,0.25 90 top
U$28  [RST2]  0.64,33.27 90 top
U$30  [QWIIC_COPYRIGHT_MEDIUM]  48.26,15.24 270 bottom
U$31  [MOSI16]  26.8,5.33 0 bottom
U$32  [BATT25]  3.68,5.59 270 bottom
U$33  [D50]  34.42,5.33 0 bottom
U$34  48.26,16.64 90 top
U$35  [SOLDER_TO_BYPASS_VUSB_FUSE1]  50.8,33.78 0 bottom
U$36  [OFF#ON1]  10.54,4.7 0 bottom
U$37  [SWITCH6]  13.46,4.95 270 bottom
U$38  [GND0]  17.4,39.37 0 bottom
U$39  [SCK5]  26.54,35.31 0 top
U$41  [RST2]  37.21,5.33 0 bottom
U$42  [A43]  31.88,35.31 0 bottom
U$43  [A34]  34.42,35.31 0 bottom
U$44  [A25]  36.96,35.31 0 bottom
U$45  [A16]  39.5,35.31 0 bottom
U$46  [A07]  42.16,35.31 0 bottom
U$47  [MISO8]  24.77,35.31 0 bottom
U$48  [MOSI9]  27.56,35.31 0 bottom
U$49  [SCK10]  29.84,35.31 0 bottom
U$50  [ANT11]  45.09,35.31 0 bottom
U$51  [QWIIC_COPYRIGHT_MEDIUM]  48.26,25.4 90 top
U$52  [RAW21]  19.68,5.33 0 bottom
U$53  [3V320]  21.97,5.33 0 bottom
U$55  [D514]  31.62,5.33 0 top
U$57  [TX3]  39.62,5.33 0 bottom
U$58  [SPARKX-MEDIUM]  48.26,24.13 270 bottom
U$59  [D130]  49.45,9.96 0 top
U$60  [SCK18]  29.21,5.33 0 bottom
U$61  [OSHW-LOGO-MINI]  41.53,20.32 90 top
U$62  [GND0]  44.96,1.27 0 bottom
U$63  [PWR-()-03]  49.5,11.52 0 top
U$64  [QWIIC_COPYRIGHT_SMALL]  48.26,1.27 0 bottom
U$65  [SPI11]  30.23,6.73 0 bottom
U$67  [QWIIC_COPYRIGHT_SMALL]  48.26,39.37 0 bottom
U$69  [TX3]  36.58,5.33 0 top
U$70  [TX6]  49.43,6.92 0 top
U$72  [RX7]  49.43,8.45 0 top
U$73  [RX2]  39.24,5.33 0 top
U$81  [SAMD21_PRORF_1W5]  50.55,11.43 90 top
Y1  36.64,18.16 0 top

### Tracks (layer width: path | path; a pad name or v marks a point on that pad's centre or on a via)
3.3V  (via drill 0.38)
  Top 0.152: U6.5 19.1,18.16 19.19,18.24 19.48,18.24 | 22.59,18.16 22.51,18.24 19.48,18.24 | U6.6 19.5,18.22 19.48,18.24 | C5.2 v29.08,8.64 | U1.36 36.91,9.14 36.36,9.69 35.97,9.69 v35.81,9.84 33.95,11.7 33.95,12.62 34.43,13.09 34.43,13.65 33.16,14.92 31.89,14.92 31.56,14.59 31.56,13.27 31.5,13.21 31.23,12.94 U1.17 | U1.43 38.1,12.44 38.35,12.7 38.35,12.95 | C6.2 38.65,13.88 38.35,13.59 38.35,12.95 | Q2.1 23.11,18.76 23.31,18.96 23.31,19.23 24.65,20.57 v24.77,20.57 | U1.44 37.58,12.95 38.35,12.95
  Top 0.305: Q2.1 22.59,18.16 22.59,17.73 R10.2 | R1.2 C4.2 41.57,8.42 41.85,8.7 42.04,8.89 42.04,11.49 | U4.7 21.11,9.12 20.95,9.27 20.95,10.41 | 20.95,10.41 20.95,10.55 20.97,10.56 20.97,11.1 20.41,11.66 R7.2 20.45,12.21 v20.45,13.21 | U4.8 22.33,10.41 20.95,10.41 | 29.17,22.58 29.59,22.16 | R8.2 42.04,11.49 | 42.04,11.49 42.04,12.45 41.66,12.83 40.01,12.83 | 40.01,12.83 39.62,12.83 39.5,12.95 C6.2 | R9.2 27.42,17.73 Q1.1 27.42,19.45 27.23,19.63 27.23,22.51 27.3,22.58 | 40.01,12.83 40.01,11.63 v39.93,11.56
  Top 0.457: R13.2 R14.2
  Top 0.508: U2.5 29.65,28 C10.+
  Top 0.61: 30.1,27.27 C11.1 C13.2 35.34,27.27 35.94,26.67 35.94,24.51 | 30.1,27.27 29.43,27.27 v29.21,27.05 | R8.2 44.01,12.26 44.32,12.57 v45.85,12.57 46.35,13.08 46.35,19.94 46.35,21.59 46.35,22.86 46.35,24.42 46.48,24.55 | 29.59,22.16 v29.51,22.24 29.17,22.58 27.3,22.58 v22.76,22.58 | C10.+ 30.1,27.27 | J6.2 18.92,5.21 16,5.21 14.1,7.11 14.1,8 | U4.3 14.25,7.85 14.1,8 | 14.1,8 v14.1,19.05 | J13.2 47.76,5.9 D2.A 48.78,7.62 | 48.78,7.62 D1.A | 48.78,7.62 v49.78,7.62 | J11.2 48.76,34.68 49.42,34.02 | 49.42,34.02 v51.54,34.02 | v51.3,24.26 51,24.55 46.48,24.55 | R13.2 48.81,30.9 49.42,31.52 49.42,34.02 | 35.94,24.51 L1.1 | 35.94,24.51 35.98,24.55 43.69,24.55 | 46.48,24.55 43.69,24.55 | J14.1 43.81,24.42 43.69,24.55
  Bottom 0.152: v24.77,20.57 26.45,22.24 v29.51,22.24
  Bottom 0.305: v29.08,8.64 29.15,8.7 31.88,8.7 34.16,8.7 35.81,8.7 | 35.81,8.7 39.88,8.7 39.93,8.75 v39.93,11.56 | v35.81,9.84 35.81,8.7
  Bottom 0.61: v29.21,27.05 29.25,27.01 29.25,22.5 v29.51,22.24 | v49.78,7.62 49.78,8.64 v45.85,12.57 | v51.54,34.02 51.54,26.22 50.8,25.48 50.8,24.82 51.3,24.32 v51.3,24.26 | 20.45,19.05 20.45,21.83 21.13,22.52 21.84,22.52 | 20.45,19.05 v20.45,13.21 | v14.1,19.05 20.45,19.05 | 21.84,22.52 22.35,22.52 22.69,22.52 | v22.76,22.58 22.69,22.52 | 22.69,22.52 21.84,22.52
5V  (via drill 0.38)
  Top 0.152: R11.2 29.88,17.57 29.7,17.38 29.7,16.67 29.63,16.6 29.41,16.38 26.67,16.38 26.42,16.64 26.42,17.4 26.25,17.57 R12.2 25.03,17.57 24.92,17.68 24.92,19.3 24.93,19.31 24.93,19.91 25.06,20.04 26.27,20.04 26.54,20.32 26.54,20.95 26.34,21.16 24.08,21.16 23.82,20.9 23.82,20.16 23.69,20.03 21.81,20.03 21.59,19.81 21.59,18.8 21.34,18.55 19.25,18.55 19.1,18.69 U6.16 19.1,20.06 18.17,21 18.17,21.38 19.01,22.22 19.01,22.23 20.74,23.95 v24.7,23.95
  Top 0.508: C12.+ 23.95,28 U2.1 26.36,28 26.54,27.81 26.54,26.29 26.36,26.1 U2.3
  Top 0.61: D5.C C15.2 C14.1 21.46,26.94 D4.C 21.46,28.91 v21.74,29.19 23.26,29.19 23.5,28.96 C12.+ | v7.37,35.05 14.47,35.05 14.98,34.54 23.76,34.54 v23.8,34.51
  Bottom 0.152: v21.74,29.19 21.74,27.7 21,26.96 21,24.64 21.68,23.95 v24.7,23.95
  Bottom 0.61: U5.P$11 7.31,35 v7.37,35.05 | v23.8,34.51 23.8,29.76 23.23,29.19 v21.74,29.19
!E19_CS  (via drill 0.38)
  Top 0.152: R10.1 24.09,16.88 24.21,16.76 25.51,16.76 27.16,15.11 v27.18,15.11 | U1.28 32.91,9.53 33.53,10.14 v33.53,10.51
  Top 0.305: Q2.2 23.89,17.73 R10.1
  Bottom 0.152: v27.18,15.11 27.99,15.11 31.64,11.46 32.59,11.46 v33.53,10.51
!E19_CS5V  (via drill 0.38)
  Top 0.152: R12.1 26.38,19.27 26.85,19.74 26.85,21.08 26.5,21.43 26.15,21.78 v23.75,21.78 23.24,21.27 Q2.3 | v19.94,24.14 20.06,24.26 22.23,24.26 22.54,24.57 v25.27,24.57
  Bottom 0.152: U5.P$15 17.47,34.47 17.27,34.67 14.1,34.67 13.95,34.52 13.95,24.15 14.8,23.3 18.06,23.3 18.64,22.73 19.11,22.73 19.94,23.56 v19.94,24.14 | v23.75,21.78 25.27,23.31 v25.27,24.57
!E19_RST  (via drill 0.38)
  Top 0.152: U1.22 31.52,10.44 33.02,11.94 v33.02,13.21 | v30.61,20.57 30.1,20.57 29.59,20.07 29.59,18.92 29.43,18.76 Q1.2
  Top 0.305: Q1.2 28.72,17.73 R9.1
  Bottom 0.152: v30.61,20.57 v30.6,20.57 30.6,14.22 31.49,13.34 31.5,13.34 31.62,13.21 v33.02,13.21
!E19_RST5V  (via drill 0.38)
  Top 0.152: Q1.3 28.07,21.21 28.19,21.34 30.61,21.34 | 30.61,21.34 31.11,21.34 31.54,20.91 31.54,19.47 31.33,19.27 R11.1 | v28.07,23.38 29.96,23.38 30.61,22.73 30.61,21.34
  Top 0.254: v7.87,9.91 9.88,11.91 9.94,11.91 13.21,15.19 13.21,19.04 14.11,19.94 v16.51,19.94
  Bottom 0.254: U5.P$8 7.31,9.34 v7.87,9.91 | v16.51,19.94 18.85,19.94 19.86,20.95 19.86,22.07 20.99,23.2 23.01,23.2 23.38,22.84 23.38,22.29 23.13,22.04 23.13,21.52 23.49,21.16 24.08,21.16 26.3,23.38 v28.07,23.38
!RST  (via drill 0.38)
  Top 0.152: U1.40 38.61,10.94 | 38.61,10.94 38.73,10.94 | 38.73,10.94 39.1,10.94 39.24,10.79 R1.1 | v38.73,11.56 38.73,10.94 | J6.8 35.56,6.33 36.34,7.11 v36.83,7.11 | v42.04,7.49 38.73,7.49 38.51,7.71 38.51,10.85 38.61,10.94
  Top 0.254: S1.4 S1.3 4.18,37.59 5.22,36.55 6.21,36.55 6.22,36.56 6.48,36.56 6.74,36.83 16.13,36.83 16.38,37.08 16.38,37.72 16.76,38.1 31.24,38.1 31.75,37.59 31.75,33.02 v35.56,29.21
  Bottom 0.152: v38.73,11.56 38.73,16.16 38.85,16.27 39.22,16.64 41.27,16.64 | v36.83,7.11 41.66,7.11 v42.04,7.49 | J14.10 43.94,16.64 41.27,16.64 | 41.27,16.64 41.27,21.59 35.56,27.3 v35.56,29.21
A0  (via drill 0.38)
  Top 0.152: v35.81,16.64 35.91,16.54 U1.3
  Bottom 0.152: J7.9 39.17,35.36 34.95,35.36 33.93,34.34 33.93,25.15 34.67,24.41 34.67,17.78 v35.81,16.64
A1  (via drill 0.38)
  Top 0.152: U1.7 33.91,16.12 32.76,17.28 32.76,21.87 33.97,23.08 v33.97,23.71
  Bottom 0.152: J7.8 36.93,35.66 34.82,35.66 33.63,34.47 33.63,25.02 33.97,24.68 v33.97,23.71
A2  (via drill 0.38)
  Top 0.152: U1.8 33.41,16.19 32.45,17.15 32.45,22.37 v33.29,23.21
  Bottom 0.152: J7.7 33.33,34.59 33.33,24.89 33.59,24.62 33.59,24.15 33.29,23.84 v33.29,23.21
A3  (via drill 0.38)
  Top 0.152: v33.02,24.38 33.02,23.75 32.15,22.88 32.15,16.95 32.91,16.19 U1.9
  Bottom 0.152: v33.02,24.38 J7.6
A4  (via drill 0.38)
  Top 0.152: U1.10 32.41,16.26 31.84,16.82 31.84,23.38 v32.34,23.88
  Bottom 0.152: J7.5 32.72,34.59 32.72,24.89 32.34,24.52 v32.34,23.88
ANT
  Bottom 0.152: U5.P$19 42.61,27.12 43.18,27.69 J12.1
  pour Bottom (no thermals): 42.38,36.83 42.38,27.94 39.65,27.94 39.65,26.34 42.1,26.34 43.98,28.21 43.98,36.83 arc90 43.18,37.63 arc90
D5  (via drill 0.38)
  Top 0.152: J6.7 v33.02,5.86 | U1.24 29.69,9.44 v29.59,9.35
  Bottom 0.152: v33.02,5.86 31.38,7.49 29.42,7.49 28.51,8.4 28.51,8.87 28.85,9.21 29.45,9.21 v29.59,9.35
D8_!FLASH_CS
  Top 0.152: U4.1 16.76,12.19 | 16.76,12.19 16.76,13.46 17.14,13.84 20.7,13.84 22.86,11.68 23.16,11.68 23.18,11.66 24.75,11.66 26.93,13.84 27.3,13.84 30.02,16.56 31.68,16.56 31.91,16.32 U1.11 | R7.1 18.68,12.19 16.76,12.19
D9  (via drill 0.38)
  Top 0.152: U1.12 31.41,16.09 31.24,16.26 30.15,16.26 27.39,13.5 27.01,13.5 26.42,12.9 v26.42,12.53
  Bottom 0.152: v26.42,12.53 26.07,12.18 26.07,5.83 25.22,4.98 24.92,4.98 23.75,3.81 J6.3
D10  (via drill 0.38)
  Top 0.152: U6.9 20.7,16.84 21.39,16.15 25.26,16.15 26.25,15.17 26.25,14.4 24.87,13.03 v24.72,13.03 | v32.69,10.54 32.69,10.15 32.41,9.87 U1.27
  Bottom 0.152: v24.72,13.03 25.26,13.03 26.64,14.4 28.27,14.4 32.13,10.54 v32.69,10.54
D11  (via drill 0.38)
  Top 0.152: U6.10 21.1,16.87 21.51,16.46 25.39,16.46 26.55,15.29 26.55,14.48 26.55,14.05 24.95,12.45 23.63,12.45 v23.41,12.23 | U1.25 31.41,9.22 v31.84,9.65
  Bottom 0.152: v23.41,12.23 23.63,12.45 25.12,12.45 26.77,14.1 28.14,14.1 31.84,10.4 v31.84,9.65
D13  (via drill 0.38)
  Top 0.152: R4.2 42.88,9.98 v42.8,9.91 | U1.26 31.91,7.96 v32,7.87
  Bottom 0.152: v32,7.87 32.38,8.26 41.15,8.26 v42.8,9.91
D+  (via drill 0.38)
  Top 0.152: U1.34 35.91,7.11 35.41,6.6 31.24,6.6 v29.21,4.57
  Top 0.406: J1.D+ 6.22,25.4 v6.73,24.89
  Bottom 0.152: v6.73,24.89 7,24.62 7,11.67 8.57,10.1 8.57,5.7 8.98,5.28 20.5,5.28 21.49,4.29 21.49,3.53 22.38,2.64 28.42,2.64 29.11,3.33 29.11,4.47 v29.21,4.57
D-  (via drill 0.38)
  Top 0.152: U1.33 35.41,7.22 35.1,6.91 29.84,6.91 28.19,6.91 | 25.53,6.91 25.15,6.91 25.53,6.91 | 25.53,6.91 25.65,6.91 26.29,6.91 28.19,6.91 | 28.19,6.91 25.12,6.91 v23.8,8.23
  Top 0.406: J1.D- 6.59,26.05 v6.73,25.91
  Bottom 0.152: v6.73,25.91 7.3,25.34 7.3,11.8 8.87,10.23 8.87,5.83 9.11,5.59 23.29,5.59 23.53,5.83 23.53,6.48 23.53,7.96 v23.8,8.23
DIO05V  (via drill 0.38)
  Top 0.152: v21.46,21.72 21.46,21.26 20.3,20.1 U6.13
  Bottom 0.152: U5.P$7 9.85,9.6 10.52,10.26 16.89,10.26 20.57,10.26 21.23,10.92 21.23,21.49 v21.46,21.72
DIO15V  (via drill 0.38)
  Top 0.152: v22.35,21.72 20.7,20.07 U6.12
  Bottom 0.152: U5.P$6 12.39,9.6 12.75,9.96 20.7,9.96 21.54,10.79 21.54,20.82 22.35,21.64 v22.35,21.72
DIO25V  (via drill 0.38)
  Top 0.152: U6.11 21.1,19.96 21.97,20.83 v22.35,20.83
  Bottom 0.152: U5.P$5 14.93,9.47 15.11,9.65 20.83,9.65 21.84,10.67 21.84,20.32 v22.35,20.83
E19_INT  (via drill 0.38)
  Top 0.152: U6.8 20.3,16.81 21.26,15.85 25.13,15.85 25.94,15.04 25.94,14.53 25.84,14.42 | 25.84,14.42 25.04,13.62 24.18,13.62 v24.16,13.65 | U1.29 33.41,9.58 33.48,9.65 34.26,10.43 v34.42,10.43 | 25.84,14.42
  Bottom 0.152: v24.16,13.65 24.53,13.65 24.56,13.62 25.42,13.62 26.25,14.44 26.25,14.99 26.94,15.68 27.85,15.68 31.77,11.76 33.09,11.76 v34.42,10.43
E19_RXEN  (via drill 0.38)
  Top 0.152: U6.7 19.9,16.78 21.14,15.54 24.63,15.54 v25.37,14.8 | U1.38 37.05,9.94 35.1,11.89 v35.1,12.95
  Bottom 0.152: v25.37,14.8 25.64,15.07 25.64,15.24 26.69,16.29 26.92,16.29 | 26.92,16.29 | 26.92,16.29 28.1,16.29 31.76,12.64 34.78,12.64 v35.1,12.95
E19_RXEN5V  (via drill 0.38)
  Top 0.152: v19.22,21.19 19.9,20.5 U6.14
  Bottom 0.152: U5.P$17 22.55,30.8 20.69,28.95 20.69,24.09 20.51,23.91 20.51,23.7 19.22,22.41 v19.22,21.19
E19_TXEN  (via drill 0.38)
  Top 0.152: U6.4 18.7,16.93 20.4,15.24 24.33,15.24 24.8,14.77 v24.8,14.19 | U1.37 37.04,9.44 34.53,11.96 v34.53,12.06
  Bottom 0.152: v24.8,14.19 25.57,14.19 25.94,14.57 25.94,15.12 26.82,15.99 27.97,15.99 31.9,12.06 v34.53,12.06
E19_TXEN5V  (via drill 0.38)
  Top 0.152: v18.88,23.3 18.7,23.13 18.7,22.34 17.86,21.5 17.86,20.87 18.7,20.03 U6.17
  Bottom 0.152: U5.P$16 20.01,30.3 19.37,29.65 19.37,23.79 v18.88,23.3
EEPROM_MISO  (via drill 0.38)
  Top 0.152: v28.08,9.63 28.39,9.94 U1.23 | v31.62,6.03 30.48,4.89 J6.6 29.31,2.64 24.92,2.64 24.23,3.33 24.23,4.09 23.34,4.98 22.71,4.98 18.57,9.12 U4.2
  Bottom 0.152: v28.08,9.63 27.59,9.14 27.59,7.24 28.46,6.37 31.29,6.37 v31.62,6.03
EEPROM_MOSI  (via drill 0.38)
  Top 0.152: v27.23,12.9 29.26,14.94 U1.13 | J6.4 25.4,5.39 24.21,6.58 U4.5
  Bottom 0.152: J6.4 25.4,4.73 26.37,5.7 26.37,11.67 27.23,12.53 v27.23,12.9
EEPROM_SCLK  (via drill 0.38)
  Top 0.152: v28.31,12.96 29.79,14.44 U1.14 | U4.6 23.37,7.85 27.41,3.81 J6.5
  Bottom 0.152: J6.5 27.94,4.45 26.68,5.71 26.68,11.55 27.82,12.7 28.04,12.7 v28.31,12.96
GND  (via drill 0.38)
  Top 0.152: C5.1 25.15,8.64 24.71,9.07 v23.8,9.07
  Top 0.254: 42.16,4.45 42.8,5.08 J13.1
  Top 0.305: J10.3 21.57,2.56 21.57,4.33 21.33,4.56 | 21.01,4.88 21.33,4.56 | v21.68,4.91 21.33,4.56
  Top 0.406: J1.GND 7.67,24.1 8.03,23.75 9.91,23.75 10.29,23.37 10.29,22.48 10.54,22.23
  Top 0.508: U2.2 23.88,27.05
  Top 0.61: J5.P$4 J5.GND | C14.2 22.14,25.18 22.35,25.4 | D3.C 49.99,9.98 50.29,10.29 50.29,11.18 50.29,13.34 v49.15,14.48 | C10.- 29.17,25.65 28.89,25.37 24.71,25.37
  Top 1.219: J4.1 v12.7,39.37 | J10.1 J10.2 J10.3 J10.4 J10.5 J10.6 J10.7 J10.8 J10.9 J10.10 | J9.9 J9.8 J9.7 J9.6 J9.5 J9.4 J9.3 J9.2 J9.1
  Bottom 0.152: v23.8,9.07 25.22,9.07 25.27,9.02
  Bottom 0.305: U5.P$18 25.78,33.31 25.78,33.5 26.88,34.59 29.92,34.59 v30.99,33.53 | v21.68,4.91 22.2,4.91 22.34,5.05 23.3,5.05 23.91,5.67
  Bottom 0.61: 25.27,9.02 v25.27,11.3
  other vias: 50.8,34.92 36.58,11.43 32.13,14.35 40.77,11.56 44.96,14.73 47.75,14.48 3.05,16.38 5.97,16.38 3.05,10.03 6.86,10.03 34.42,14.48 11.43,39.37 12.7,38.1 35.31,34.54 35.31,33.27 35.31,32.38 33.91,20.7
  pour Top (isolate 0.152, rank 2): 53.34,40.64 0,40.64 0,30.48 6.35,30.48 6.35,20.32 0,20.32 0,0 53.34,0
  pour Bottom (isolate 0.152, rank 2): 0,40.64 53.34,40.64 53.34,0 0,0 0,20.32 6.35,20.32 6.35,30.48 0,30.48
MISO  (via drill 0.38)
  Top 0.152: U6.2 17.9,16.76 20.04,14.63 22.99,14.63 v23.25,14.36 | U1.21 27.05,10.94 26.02,9.91 v23.62,9.91
  Bottom 0.152: J7.2 24.64,35.05 30.96,35.05 31.8,34.22 31.8,25.33 31.37,24.89 | v23.62,9.91 23.62,10.79 22.45,11.95 22.45,13.29 23.25,14.09 v23.25,14.36 23.25,14.64 30.39,21.77 30.39,23.92 31.37,24.89 | 31.37,24.89
MISO5V  (via drill 0.38)
  Top 0.152: U6.19 17.9,19.97 17.21,20.66 17.21,21.72 17.73,22.23 v17.73,22.73
  Bottom 0.152: U5.P$13 12.39,30.99 12.34,30.94 12.34,30.73 12.47,30.61 13.46,30.61 13.65,30.42 13.65,24.02 14.67,23 17.47,23 v17.73,22.73
MOSI  (via drill 0.38)
  Top 0.152: U6.3 18.3,16.9 20.27,14.94 23.82,14.94 v24.09,14.67 | U1.19 30.04,11.94 29.65,11.55 26.8,11.55 25.76,10.52 24.63,10.52 v24.36,10.78
  Bottom 0.152: J7.3 26.87,35.36 31.09,35.36 32.11,34.34 32.11,25.2 30.69,23.79 30.69,21.65 30.05,21 24.09,15.05 v24.09,14.67 24.09,14.39 22.76,13.06 22.76,12.08 24.06,10.78 v24.36,10.78
MOSI5V  (via drill 0.38)
  Top 0.152: v18.8,24.14 18.3,23.65 18.3,22.38 17.52,21.59 17.52,20.79 18.3,20 U6.18
  Bottom 0.152: U5.P$14 14.93,30.79 15.03,30.69 17.14,30.69 18.9,28.93 18.9,24.24 v18.8,24.14
N$1
  Top 0.61: R2.2 D1.C
N$2
  Top 0.61: R3.2 D2.C
N$3
  Top 0.61: D3.A R4.1
N$6
  Top 0.152: U1.1 36.91,17.99 37.08,18.16 Y1.P$2 37.89,19.22 38.06,19.39 C1.2
N$7
  Top 0.152: U1.2 36.41,17.94 36.2,18.16 Y1.P$1 35.39,19.22 35.22,19.39 C2.2
N$12  (via drill 0.38)
  Top 0.508: D4.A 27.43,30.61 27.7,30.34 F1.1
  Top 0.61: v28.7,29.59 F1.1
  Bottom 0.61: JP1.1 29.72,33.66 29.84,33.53 29.84,30.23 29.21,29.59 v28.7,29.59
N$13
  Top 0.61: R5.1 15.37,27.69 | 15.37,27.69 R6.2 | U3.1 8.87,26.9 9.65,27.69 15.37,27.69
N$14  (via drill 0.38)
  Top 0.61: U3.2 11.12,25.53 v10.03,25.53 | D5.A 19.94,33.15 19.43,33.66 11.81,33.66 11.18,33.02 U3.4 10.03,30.53 v10.03,29.59 13.46,29.59 14.06,30.19 R5.2
  Bottom 0.61: v10.03,25.53 v10.03,29.59
N$38
  Top 0.61: R8.1 D6.A
RAW  (via drill 0.38)
  Top 0.61: S2.2 8.37,5.58 8.64,5.84 13.21,5.84 | 13.21,5.84 J8.1 | 13.21,5.84 v13.21,12.06 | v12.32,25.4 12.39,25.48 U3.3
  Top 1.219: J6.1 J8.1
  Bottom 0.61: v12.32,25.4 12.32,12.95 v13.21,12.06
RX_LED  (via drill 0.38)
  Top 0.152: U1.48 38.51,14.94 38.65,14.8 43.24,14.8 v43.56,14.48 | v42.93,8.51 42.99,8.45 R2.1
  Bottom 0.152: v42.93,8.51 43.56,9.14 v43.56,14.48
RXI  (via drill 0.38)
  Top 0.152: U1.16 30.1,13.44 29.09,12.43 v29.09,12.12
  Bottom 0.152: J6.10 39.17,5.28 31.56,5.28 30.79,6.06 28.34,6.06 27.29,7.11 27.29,10.54 28.57,11.82 28.79,11.82 v29.09,12.12
SCK  (via drill 0.38)
  Top 0.152: v22.42,14.06 22.15,14.33 19.53,14.33 17.5,16.36 U6.1 | U1.20 29.97,11.44 29.78,11.25 26.93,11.25 25.89,10.21 24.12,10.21 23.42,10.92 22.68,10.92 v22.42,11.18 | v30.05,24.38 30.61,24.38 31.27,23.72 v31.27,23.11
  Bottom 0.152: J7.4 29.11,35.66 31.22,35.66 32.41,34.47 32.41,25.02 31.27,23.88 v31.27,23.11 | v22.42,11.18 22.15,11.45 22.15,13.79 v22.42,14.06 22.42,14.33 30.08,22 30.08,24.35 v30.05,24.38
SCK5V  (via drill 0.38)
  Top 0.152: U6.20 17.5,19.94 16.91,20.53 v16.91,22.37
  Bottom 0.152: U5.P$12 9.85,30.79 10.34,30.3 13.21,30.3 13.34,30.17 13.34,23.9 14.54,22.7 16.59,22.7 v16.91,22.37
SCL  (via drill 0.38)
  Top 0.152: U1.32 34.91,7.55 v34.84,7.48
  Top 0.305: J11.4 46.76,36.73 47.24,37.21 50.55,37.21 52.32,35.43 v52.7,35.43 | v52.7,4.06 v50.42,4.06 49.91,4.06 49.76,4.21 J13.4
  Top 0.457: J11.4 46.76,34.19 46.48,33.91 R14.1
  Bottom 0.305: v52.7,35.43 v52.7,4.06 | v34.84,7.48 36.2,6.12 39.69,6.12 40.3,5.51 47.62,5.51 49.07,4.06 v50.42,4.06
SDA  (via drill 0.38)
  Top 0.152: U1.31 34.41,7.9 v34,7.49
  Top 0.305: J11.3 47.76,36.46 48.01,36.7 50.16,36.7 51.94,34.92 v51.94,34.8 | v50.93,3.3 49.4,3.3 48.76,3.94 J13.3
  Top 0.457: J11.3 47.76,34.16 48.01,33.91 R13.1
  Bottom 0.305: v51.94,34.8 52.25,34.49 52.25,4.62 v50.93,3.3 49.12,3.3 47.37,5.05 40.11,5.05 39.5,5.66 35.74,5.66 34.19,7.21 34.19,7.3 v34,7.49
SHLD  (via drill 0.38)
  other vias: 0.89,21.59
  pour Bottom (isolate 0.203): 5.84,29.97 0,29.97 0,21.08 5.84,21.08
  pour Top (isolate 0.203): 0,29.97 5.84,29.97 5.84,21.08 0,21.08
SWDCLK  (via drill 0.38)
  Top 0.152: U1.45 36.91,13.44 36.81,13.35 36.81,12.43 36.58,12.19 v35.81,12.19 | v44.2,16.07 43.93,16.33 43.41,16.33 41.7,18.05 v40.64,18.05
  Bottom 0.152: v35.81,12.19 35.67,12.34 35.67,13.95 39.24,17.53 39.77,18.05 v40.64,18.05 | J14.4 45.09,21.35 46.12,20.32 46.12,16.99 45.2,16.07 v44.2,16.07
SWDIO  (via drill 0.38)
  Top 0.152: U1.46 36.96,13.94 36.24,13.23 v36.24,12.95 | v40.64,17.21 42.1,17.21 43.82,15.49 v45.47,15.49
  Bottom 0.152: v36.24,12.95 36.24,14.09 39.36,17.21 v40.64,17.21 | v45.47,15.49 46.42,16.45 46.42,21.52 J14.2
TX_LED
  Top 0.152: U1.39 38.07,10.44 38.21,10.3 38.21,7.59 38.61,7.19 41.53,7.19 41.8,6.92 42.27,6.92 42.61,7.26 43.67,7.26 R3.1
TXO  (via drill 0.38)
  Top 0.152: U1.15 30.1,13.94 28.28,12.12 v28.06,12.12
  Bottom 0.152: J6.9 36.93,4.98 31.44,4.98 30.66,5.76 28.21,5.76 26.98,6.99 26.98,11.04 v28.06,12.12
V_USB  (via drill 0.38)
  Top 0.254: v24.89,29.59 24.64,29.84 19.3,29.84 17.4,29.84 16.89,29.34 C8.1
  Top 0.406: J1.VBUS 6.51,26.7 v6.73,26.92
  Top 0.61: v6.1,35.05 7.03,35.98 C3.2 15.91,35.31 17.78,35.31 | 17.78,35.31 24.13,35.31 26.39,33.05 v26.39,31.37 | J4.2 17.78,35.31 | F1.2 v24.89,29.59
  Bottom 0.61: v6.73,26.92 6.73,30.1 6.1,30.73 6.1,34.54 v6.1,35.05 | v24.89,29.59 25.65,29.59 26.39,30.33 v26.39,31.37 26.39,33.25 26.8,33.66 JP1.2
VBATT  (via drill 0.38)
  Top 0.61: C9.+ 8.89,19.68 8.11,18.91 J5.VIN0 1.89,18.91 1.27,18.29 J3.2 1.91,5.71 2.92,5.71 2.92,5.7 v3.81,4.82 3.85,4.78 4.66,4.78 4.87,4.57 S2.3
  Bottom 0.61: J8.2 14.61,1.91 9.4,1.91 5.75,1.91 5.21,2.44 5.21,3.41 v3.81,4.82
VDDANA  (via drill 0.38)
  Top 0.152: U1.6 34.41,16.07 v34.98,16.64
  Top 0.203: C7.2 v37.47,19.81
  Top 0.61: L1.2 C7.2
  Bottom 0.203: v37.47,19.81 37.47,16.65 36.57,15.75 35.86,15.75 35.71,15.9 35.57,16.04 35.45,16.15 35.22,16.39 35.22,16.4 v34.98,16.64

### Text on the board
Bottom: x02
tPlace: + | -
bPlace: + | -
tValues: Tall Cap Tactile | BAT60A | BAT60A | Ferrite Chip 30 Ohm | N-ch | N-ch
bValues: RFM69 / or / RFM95W
tDocu: Owen Lyke